# Altium project ADCS Interface Module 2 REVB.PrjPcb (part 1 of 2)
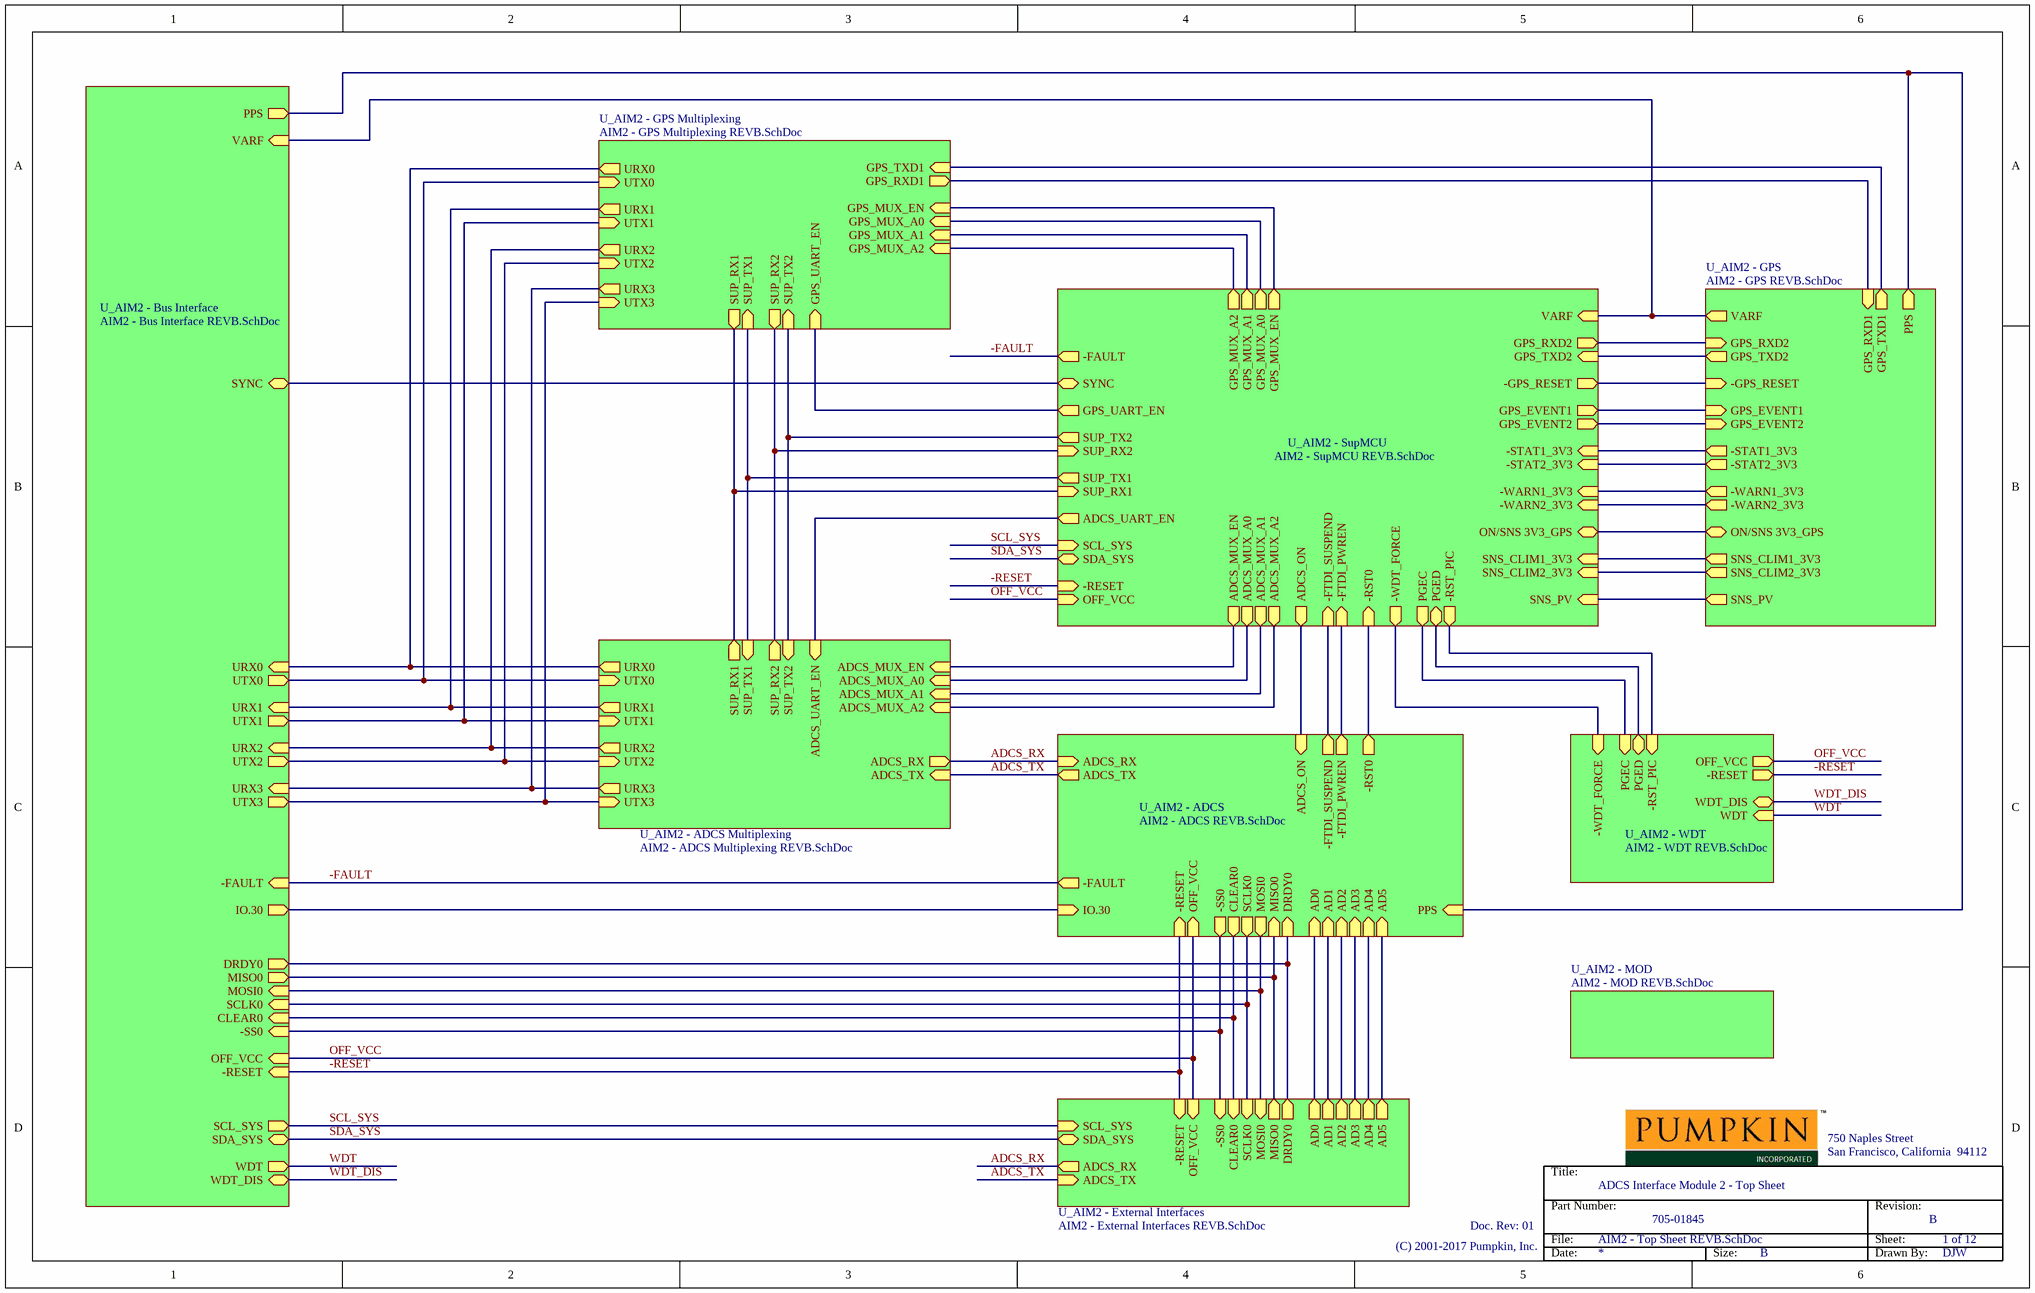
[diagram p0: AIM2 - Top Sheet REVB.SchDoc]
AssemblyNumber: 710-01846; PartNumber: 705-01845; ProjectRevision: B; ProjectTitle: ADCS Interface Module 2
12 sheets, 240 parts. Net scope: hierarchical (ports join the sheet entries above them; power ports are global).
Board file: AIM2 REVB.PcbDoc
Sheets:
  AIM2 - Top Sheet REVB.SchDoc
    U_AIM2 - WDT = AIM2 - WDT REVB.SchDoc
    U_AIM2 - ADCS = AIM2 - ADCS REVB.SchDoc
      U_AIM2 - FTDI = AIM2 - FTDI REVB.SchDoc
        U_AIM2 - UART LEDS = AIM2 - UART LEDS REVB.SchDoc
    U_AIM2 - ADCS Multiplexing = AIM2 - ADCS Multiplexing REVB.SchDoc
    U_AIM2 - Bus Interface = AIM2 - Bus Interface REVB.SchDoc
    U_AIM2 - External Interfaces = AIM2 - External Interfaces REVB.SchDoc
    U_AIM2 - GPS = AIM2 - GPS REVB.SchDoc
    U_AIM2 - GPS Multiplexing = AIM2 - GPS Multiplexing REVB.SchDoc
    U_AIM2 - SupMCU = AIM2 - SupMCU REVB.SchDoc
    U_AIM2 - MOD = AIM2 - MOD REVB.SchDoc

## Sheet AIM2 - Top Sheet REVB.SchDoc: Top Sheet
size B; DrawnBy: DJW; DocumentNumber: 1; SheetNumber: 1; SheetTotal: 12

### Sub-sheets
U_AIM2 - ADCS = AIM2 - ADCS REVB.SchDoc: DRDY0 (in), -RST0 (out), MISO0 (in), PPS (in), CLEAR0 (out), SCLK0 (out), MOSI0 (out), -SS0 (out), -RESET (in), OFF_VCC (in), ADCS_RX (in), ADCS_TX (out), ADCS_ON (in), IO.30 (in), -FAULT (out), -FTDI_PWREN (out), -FTDI_SUSPEND (out), AD5 (in), AD4 (in), AD3 (in), AD2 (in), AD1 (in), AD0 (in)
U_AIM2 - ADCS Multiplexing = AIM2 - ADCS Multiplexing REVB.SchDoc: UTX0 (in), URX1 (out), URX0 (out), UTX1 (in), UTX2 (in), URX2 (out), URX3 (out), UTX3 (in), SUP_RX1 (out), SUP_TX1 (in), SUP_RX2 (out), ADCS_RX (out), ADCS_TX (in), SUP_TX2 (in), ADCS_MUX_EN (in), ADCS_MUX_A0 (in), ADCS_MUX_A1 (in), ADCS_MUX_A2 (in), ADCS_UART_EN (in)
U_AIM2 - Bus Interface = AIM2 - Bus Interface REVB.SchDoc: URX0 (in), URX1 (in), URX2 (in), -RESET (in), OFF_VCC (in), SDA_SYS (bidir), SCL_SYS (out), SYNC (bidir), -FAULT (in), UTX2 (out), UTX1 (out), UTX0 (out), UTX3 (out), URX3 (in), WDT (out), IO.30 (out), MISO0 (out), PPS (out), DRDY0 (out), MOSI0 (in), -SS0 (in), SCLK0 (in), CLEAR0 (in), VARF (in), WDT_DIS (bidir)
U_AIM2 - External Interfaces = AIM2 - External Interfaces REVB.SchDoc: ADCS_RX (out), AD5 (out), -RESET (in), OFF_VCC (in), SCL_SYS (in), SDA_SYS (bidir), CLEAR0 (in), SCLK0 (in), -SS0 (in), MOSI0 (in), AD4 (out), AD3 (out), AD2 (out), AD1 (out), AD0 (out), ADCS_TX (in), MISO0 (out), DRDY0 (out)
U_AIM2 - GPS = AIM2 - GPS REVB.SchDoc: GPS_TXD1 (out), GPS_TXD2 (out), SNS_PV (out), VARF (out), PPS (out), -GPS_RESET (in), GPS_RXD1 (in), GPS_RXD2 (in), GPS_EVENT1 (in), GPS_EVENT2 (in), -STAT1_3V3 (out), -STAT2_3V3 (out), -WARN1_3V3 (out), -WARN2_3V3 (out), ON/SNS 3V3_GPS (bidir), SNS_CLIM2_3V3 (out), SNS_CLIM1_3V3 (out)
U_AIM2 - GPS Multiplexing = AIM2 - GPS Multiplexing REVB.SchDoc: UTX0 (in), URX1 (out), URX0 (out), UTX1 (in), UTX2 (in), URX2 (out), URX3 (out), UTX3 (in), SUP_RX1 (out), SUP_TX1 (in), GPS_RXD1 (out), GPS_TXD1 (in), GPS_MUX_EN (in), GPS_MUX_A0 (in), GPS_MUX_A1 (in), GPS_MUX_A2 (in), GPS_UART_EN (in), SUP_TX2 (in), SUP_RX2 (out)
U_AIM2 - MOD = AIM2 - MOD REVB.SchDoc: no entries
U_AIM2 - SupMCU = AIM2 - SupMCU REVB.SchDoc: GPS_RXD2 (out), GPS_TXD2 (in), -GPS_RESET (out), GPS_EVENT1 (out), GPS_EVENT2 (out), -STAT1_3V3 (in), -STAT2_3V3 (in), -WARN1_3V3 (in), -WARN2_3V3 (in), ON/SNS 3V3_GPS (bidir), SNS_CLIM1_3V3 (in), SNS_CLIM2_3V3 (in), SNS_PV (in), VARF (in), -RST0 (in), -FTDI_PWREN (in), -FTDI_SUSPEND (in), ADCS_ON (out), ADCS_MUX_A2 (out), ADCS_MUX_A1 (out), ADCS_MUX_A0 (out), ADCS_MUX_EN (out), GPS_MUX_EN (out), GPS_MUX_A0 (out), GPS_MUX_A1 (out), GPS_MUX_A2 (out), GPS_UART_EN (out), ADCS_UART_EN (out), SUP_TX2 (out), SUP_RX2 (in), SUP_TX1 (out), SUP_RX1 (in), -WDT_FORCE (out), PGEC (out), PGED (bidir), -RST_PIC (out), SYNC (bidir), SCL_SYS (in), SDA_SYS (bidir), OFF_VCC (in), -FAULT (out), -RESET (in)
U_AIM2 - WDT = AIM2 - WDT REVB.SchDoc: WDT (in), OFF_VCC (out), -RESET (out), -WDT_FORCE (in), PGEC (in), -RST_PIC (in), PGED (bidir), WDT_DIS (bidir)

### Nets
-FAULT: sheet U_AIM2 - ADCS/-FAULT, sheet U_AIM2 - Bus Interface/-FAULT, sheet U_AIM2 - SupMCU/-FAULT
-FTDI_PWREN: sheet U_AIM2 - ADCS/-FTDI_PWREN, sheet U_AIM2 - SupMCU/-FTDI_PWREN
-FTDI_SUSPEND: sheet U_AIM2 - ADCS/-FTDI_SUSPEND, sheet U_AIM2 - SupMCU/-FTDI_SUSPEND
-GPS_RESET: sheet U_AIM2 - GPS/-GPS_RESET, sheet U_AIM2 - SupMCU/-GPS_RESET
-RESET: sheet U_AIM2 - WDT/-RESET, sheet U_AIM2 - ADCS/-RESET, sheet U_AIM2 - Bus Interface/-RESET, sheet U_AIM2 - External Interfaces/-RESET, sheet U_AIM2 - SupMCU/-RESET
-RST0: sheet U_AIM2 - ADCS/-RST0, sheet U_AIM2 - SupMCU/-RST0
-RST_PIC: sheet U_AIM2 - WDT/-RST_PIC, sheet U_AIM2 - SupMCU/-RST_PIC
-SS0: sheet U_AIM2 - ADCS/-SS0, sheet U_AIM2 - Bus Interface/-SS0, sheet U_AIM2 - External Interfaces/-SS0
-STAT1_3V3: sheet U_AIM2 - GPS/-STAT1_3V3, sheet U_AIM2 - SupMCU/-STAT1_3V3
-STAT2_3V3: sheet U_AIM2 - GPS/-STAT2_3V3, sheet U_AIM2 - SupMCU/-STAT2_3V3
-WARN1_3V3: sheet U_AIM2 - GPS/-WARN1_3V3, sheet U_AIM2 - SupMCU/-WARN1_3V3
-WARN2_3V3: sheet U_AIM2 - GPS/-WARN2_3V3, sheet U_AIM2 - SupMCU/-WARN2_3V3
-WDT_FORCE: sheet U_AIM2 - WDT/-WDT_FORCE, sheet U_AIM2 - SupMCU/-WDT_FORCE
AD0: sheet U_AIM2 - ADCS/AD0, sheet U_AIM2 - External Interfaces/AD0
AD1: sheet U_AIM2 - ADCS/AD1, sheet U_AIM2 - External Interfaces/AD1
AD2: sheet U_AIM2 - ADCS/AD2, sheet U_AIM2 - External Interfaces/AD2
AD3: sheet U_AIM2 - ADCS/AD3, sheet U_AIM2 - External Interfaces/AD3
AD4: sheet U_AIM2 - ADCS/AD4, sheet U_AIM2 - External Interfaces/AD4
AD5: sheet U_AIM2 - ADCS/AD5, sheet U_AIM2 - External Interfaces/AD5
ADCS_MUX_A0: sheet U_AIM2 - ADCS Multiplexing/ADCS_MUX_A0, sheet U_AIM2 - SupMCU/ADCS_MUX_A0
ADCS_MUX_A1: sheet U_AIM2 - ADCS Multiplexing/ADCS_MUX_A1, sheet U_AIM2 - SupMCU/ADCS_MUX_A1
ADCS_MUX_A2: sheet U_AIM2 - ADCS Multiplexing/ADCS_MUX_A2, sheet U_AIM2 - SupMCU/ADCS_MUX_A2
ADCS_MUX_EN: sheet U_AIM2 - ADCS Multiplexing/ADCS_MUX_EN, sheet U_AIM2 - SupMCU/ADCS_MUX_EN
ADCS_ON: sheet U_AIM2 - ADCS/ADCS_ON, sheet U_AIM2 - SupMCU/ADCS_ON
ADCS_RX: sheet U_AIM2 - ADCS/ADCS_RX, sheet U_AIM2 - ADCS Multiplexing/ADCS_RX, sheet U_AIM2 - External Interfaces/ADCS_RX
ADCS_TX: sheet U_AIM2 - ADCS/ADCS_TX, sheet U_AIM2 - ADCS Multiplexing/ADCS_TX, sheet U_AIM2 - External Interfaces/ADCS_TX
ADCS_UART_EN: sheet U_AIM2 - ADCS Multiplexing/ADCS_UART_EN, sheet U_AIM2 - SupMCU/ADCS_UART_EN
CLEAR0: sheet U_AIM2 - ADCS/CLEAR0, sheet U_AIM2 - Bus Interface/CLEAR0, sheet U_AIM2 - External Interfaces/CLEAR0
DRDY0: sheet U_AIM2 - ADCS/DRDY0, sheet U_AIM2 - Bus Interface/DRDY0, sheet U_AIM2 - External Interfaces/DRDY0
GPS_EVENT1: sheet U_AIM2 - GPS/GPS_EVENT1, sheet U_AIM2 - SupMCU/GPS_EVENT1
GPS_EVENT2: sheet U_AIM2 - GPS/GPS_EVENT2, sheet U_AIM2 - SupMCU/GPS_EVENT2
GPS_MUX_A0: sheet U_AIM2 - GPS Multiplexing/GPS_MUX_A0, sheet U_AIM2 - SupMCU/GPS_MUX_A0
GPS_MUX_A1: sheet U_AIM2 - GPS Multiplexing/GPS_MUX_A1, sheet U_AIM2 - SupMCU/GPS_MUX_A1
GPS_MUX_A2: sheet U_AIM2 - GPS Multiplexing/GPS_MUX_A2, sheet U_AIM2 - SupMCU/GPS_MUX_A2
GPS_MUX_EN: sheet U_AIM2 - GPS Multiplexing/GPS_MUX_EN, sheet U_AIM2 - SupMCU/GPS_MUX_EN
GPS_RXD2: sheet U_AIM2 - GPS/GPS_RXD2, sheet U_AIM2 - SupMCU/GPS_RXD2
GPS_TXD2: sheet U_AIM2 - GPS/GPS_TXD2, sheet U_AIM2 - SupMCU/GPS_TXD2
GPS_UART_EN: sheet U_AIM2 - GPS Multiplexing/GPS_UART_EN, sheet U_AIM2 - SupMCU/GPS_UART_EN
IO.30: sheet U_AIM2 - ADCS/IO.30, sheet U_AIM2 - Bus Interface/IO.30
MISO0: sheet U_AIM2 - ADCS/MISO0, sheet U_AIM2 - Bus Interface/MISO0, sheet U_AIM2 - External Interfaces/MISO0
MOSI0: sheet U_AIM2 - ADCS/MOSI0, sheet U_AIM2 - Bus Interface/MOSI0, sheet U_AIM2 - External Interfaces/MOSI0
OFF_VCC: sheet U_AIM2 - WDT/OFF_VCC, sheet U_AIM2 - ADCS/OFF_VCC, sheet U_AIM2 - Bus Interface/OFF_VCC, sheet U_AIM2 - External Interfaces/OFF_VCC, sheet U_AIM2 - SupMCU/OFF_VCC
ON/SNS 3V3_GPS: sheet U_AIM2 - GPS/ON/SNS 3V3_GPS, sheet U_AIM2 - SupMCU/ON/SNS 3V3_GPS
PGEC: sheet U_AIM2 - WDT/PGEC, sheet U_AIM2 - SupMCU/PGEC
PGED: sheet U_AIM2 - WDT/PGED, sheet U_AIM2 - SupMCU/PGED
PPS: sheet U_AIM2 - ADCS/PPS, sheet U_AIM2 - Bus Interface/PPS, sheet U_AIM2 - GPS/PPS
SCL_SYS: sheet U_AIM2 - Bus Interface/SCL_SYS, sheet U_AIM2 - External Interfaces/SCL_SYS, sheet U_AIM2 - SupMCU/SCL_SYS
SCLK0: sheet U_AIM2 - ADCS/SCLK0, sheet U_AIM2 - Bus Interface/SCLK0, sheet U_AIM2 - External Interfaces/SCLK0
SDA_SYS: sheet U_AIM2 - Bus Interface/SDA_SYS, sheet U_AIM2 - External Interfaces/SDA_SYS, sheet U_AIM2 - SupMCU/SDA_SYS
SNS_CLIM1_3V3: sheet U_AIM2 - GPS/SNS_CLIM1_3V3, sheet U_AIM2 - SupMCU/SNS_CLIM1_3V3
SNS_CLIM2_3V3: sheet U_AIM2 - GPS/SNS_CLIM2_3V3, sheet U_AIM2 - SupMCU/SNS_CLIM2_3V3
SNS_PV: sheet U_AIM2 - GPS/SNS_PV, sheet U_AIM2 - SupMCU/SNS_PV
SUP_RX1: sheet U_AIM2 - ADCS Multiplexing/SUP_RX1, sheet U_AIM2 - GPS Multiplexing/SUP_RX1, sheet U_AIM2 - SupMCU/SUP_RX1
SUP_RX2: sheet U_AIM2 - ADCS Multiplexing/SUP_RX2, sheet U_AIM2 - GPS Multiplexing/SUP_RX2, sheet U_AIM2 - SupMCU/SUP_RX2
SUP_TX1: sheet U_AIM2 - ADCS Multiplexing/SUP_TX1, sheet U_AIM2 - GPS Multiplexing/SUP_TX1, sheet U_AIM2 - SupMCU/SUP_TX1
SUP_TX2: sheet U_AIM2 - ADCS Multiplexing/SUP_TX2, sheet U_AIM2 - GPS Multiplexing/SUP_TX2, sheet U_AIM2 - SupMCU/SUP_TX2
SYNC: sheet U_AIM2 - Bus Interface/SYNC, sheet U_AIM2 - SupMCU/SYNC
URX0: sheet U_AIM2 - ADCS Multiplexing/URX0, sheet U_AIM2 - Bus Interface/URX0, sheet U_AIM2 - GPS Multiplexing/URX0
URX1: sheet U_AIM2 - ADCS Multiplexing/URX1, sheet U_AIM2 - Bus Interface/URX1, sheet U_AIM2 - GPS Multiplexing/URX1
URX2: sheet U_AIM2 - ADCS Multiplexing/URX2, sheet U_AIM2 - Bus Interface/URX2, sheet U_AIM2 - GPS Multiplexing/URX2
URX3: sheet U_AIM2 - ADCS Multiplexing/URX3, sheet U_AIM2 - Bus Interface/URX3, sheet U_AIM2 - GPS Multiplexing/URX3
UTX0: sheet U_AIM2 - ADCS Multiplexing/UTX0, sheet U_AIM2 - Bus Interface/UTX0, sheet U_AIM2 - GPS Multiplexing/UTX0
UTX1: sheet U_AIM2 - ADCS Multiplexing/UTX1, sheet U_AIM2 - Bus Interface/UTX1, sheet U_AIM2 - GPS Multiplexing/UTX1
UTX2: sheet U_AIM2 - ADCS Multiplexing/UTX2, sheet U_AIM2 - Bus Interface/UTX2, sheet U_AIM2 - GPS Multiplexing/UTX2
UTX3: sheet U_AIM2 - ADCS Multiplexing/UTX3, sheet U_AIM2 - Bus Interface/UTX3, sheet U_AIM2 - GPS Multiplexing/UTX3
VARF: sheet U_AIM2 - Bus Interface/VARF, sheet U_AIM2 - GPS/VARF, sheet U_AIM2 - SupMCU/VARF
WDT: sheet U_AIM2 - WDT/WDT, sheet U_AIM2 - Bus Interface/WDT
WDT_DIS: sheet U_AIM2 - WDT/WDT_DIS, sheet U_AIM2 - Bus Interface/WDT_DIS
NetU12_11: sheet U_AIM2 - GPS/GPS_TXD1, sheet U_AIM2 - GPS Multiplexing/GPS_TXD1
NetU12_12: sheet U_AIM2 - GPS/GPS_RXD1, sheet U_AIM2 - GPS Multiplexing/GPS_RXD1

### Notes on the sheet
- Title:
- 750 Naples Street
- San Francisco, California  94112
- Doc. Rev: 01
- File:
- Part Number:
- Revision:
- Sheet:
- (C) 2001-2017 Pumpkin, Inc.
- Date:
- Size:
- B
- Drawn By:

## Sheet AIM2 - WDT REVB.SchDoc: Watchdog Timer
size B; DrawnBy: DJW; DocumentNumber: 12; SheetNumber: 12; SheetTotal: 12
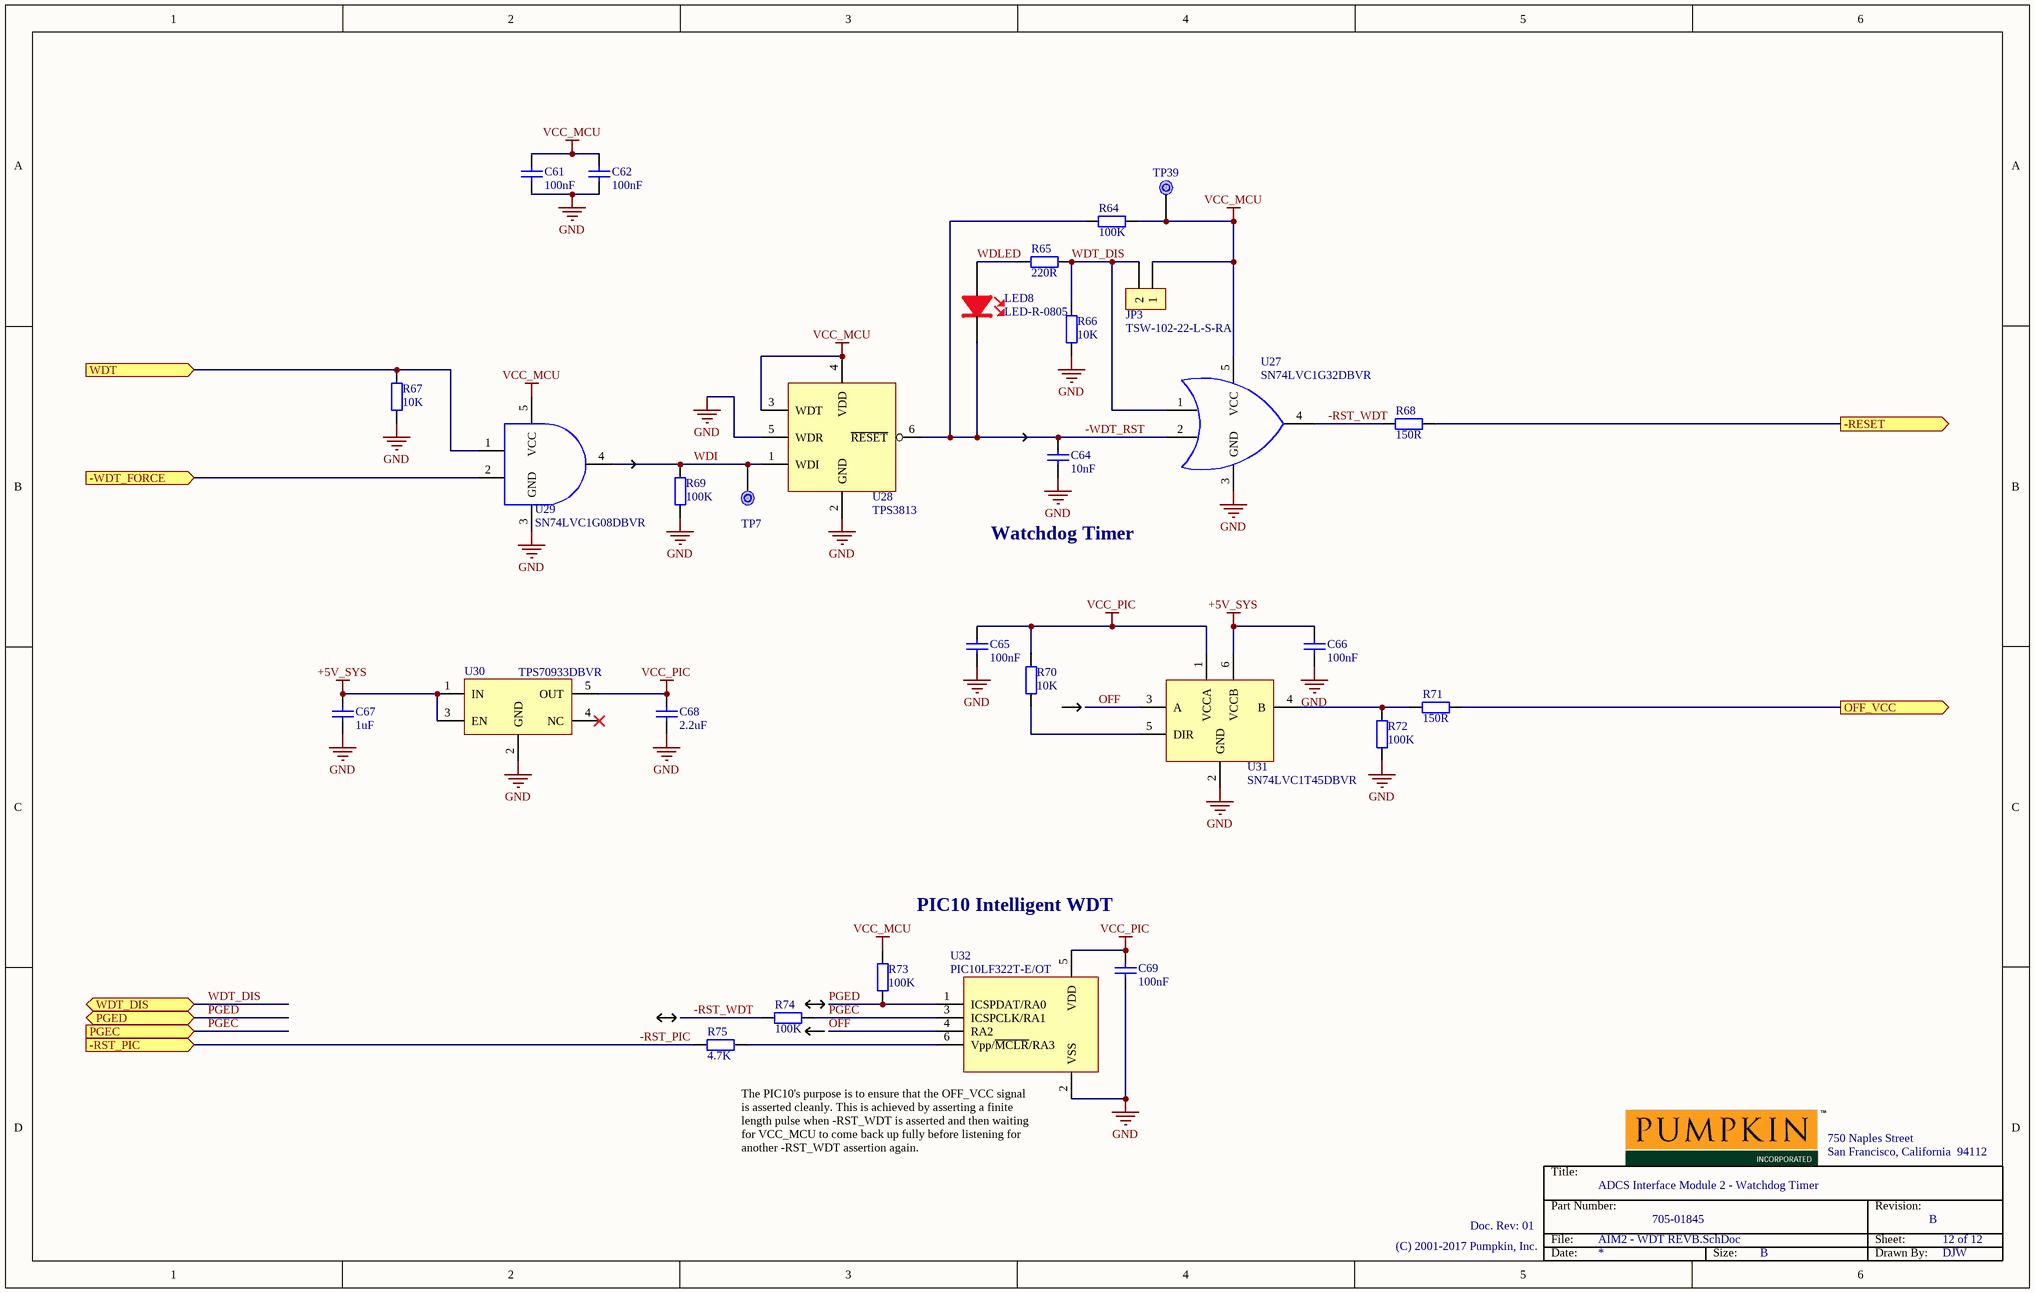
[diagram p1: AIM2 - WDT REVB.SchDoc]

### Parts
C61  100nF  [0603 CAP]
C62  100nF  [0603 CAP]
C64  10nF  [0805 CAP]
C65  100nF  [0603 CAP]
C66  100nF  [0603 CAP]
C67  1uF  [0805 CAP]
C68  2.2uF  [0805 CAP]
C69  100nF  [0603 CAP]
JP3  TSW-102-22-L-S-RA  [TSW-102-22-L-S-RA]
LED8  LED-R-0805  [0805 LED-RED]
R64  100K  [0805 RES]
R65  220R  [0805 RES]
R66  10K  [0805 RES]
R67  10K  [0805 RES]
R68  150R  [0805 RES]
R69  100K  [0805 RES]
R70  10K  [0805 RES]
R71  150R  [0805 RES]
R72  100K  [0805 RES]
R73  100K  [0805 RES]
R74  100K  [0805 RES]
R75  4.7K  [0805 RES]
TP7  Testpoint  [Testpoint]  (value not drawn)  (no BOM)
TP39  Testpoint  [Testpoint]  (value not drawn)  (no BOM)
U27  SN74LVC1G32DBVR  [SOT23-5]
U28  TPS3813  [SOT23-6]
U29  SN74LVC1G08DBVR  [SOT23-5]
U30  TPS70933DBVR  [SOT23-5]
U31  SN74LVC1T45DBVR  [SOT23-6]
U32  PIC10LF322T-E/OT  [SOT23-6]

### Ports
-RESET (out), -RST_PIC (in), -WDT_FORCE (in), OFF_VCC (out), PGEC (in), PGED (bidir), WDT (in), WDT_DIS (bidir)

### Nets
+5V_SYS: C66.2 C67.1 U30.1(IN) U30.3(EN) U31.6(VCCB)
GND: C61.1 C62.1 C64.1 C65.1 C66.1 C67.2 C68.1 C69.1 R66.1 R67.1 R69.1 R72.2 U27.3(GND) U28.2(GND) U28.5(WDR) U29.3(GND) U30.2(GND) U31.2(GND) U32.2(VSS)
VCC_MCU: C61.2 C62.2 JP3.1 R64.1 R73.2 TP39.1 U27.5(VCC) U28.3(WDT) U28.4(VDD) U29.5(VCC)
VCC_PIC: C65.2 C68.2 C69.2 R70.2 U30.5(OUT) U31.1(VCCA) U32.5(VDD)
-RESET: R68.2 ; port -RESET
-RST_PIC: R75.2 ; port -RST_PIC
-RST_WDT: R68.1 R74.1 U27.4(A+B)
-WDT_FORCE: U29.2 ; port -WDT_FORCE
-WDT_RST: C64.2 LED8.1 R64.2 U27.2(1B) U28.6(~{RESET})
OFF: U31.3(A) U32.4(RA2)
OFF_VCC: R71.2 ; port OFF_VCC
PGEC: R74.2 U32.3(ICSPCLK/RA1) ; port PGEC
PGED: R73.1 U32.1(ICSPDAT/RA0) ; port PGED
WDI: R69.2 TP7.1 U28.1(WDI) U29.4
WDLED: LED8.2 R65.1
WDT: R67.2 U29.1 ; port WDT
WDT_DIS: JP3.2 R65.2 R66.2 U27.1(1A) ; port WDT_DIS
NetR70_1: R70.1 U31.5(DIR)
NetR71_1: R71.1 R72.1 U31.4(B)
NetR75_1: R75.1 U32.6(Vpp/~{MCLR}/RA3)

Not connected (* = marked no-connect by the designer): U30 4(NC)*

### Notes on the sheet
- Watchdog Timer
- PIC10 Intelligent WDT
- (near U32) The PIC10's purpose is to ensure that the OFF_VCC signal is asserted cleanly. This is achieved by asserting a finite length pulse when -RST_WDT is asserted and then waiting for VCC_MCU to come back up fully before listening for another -RST_WDT assertion again.
- Title:
- 750 Naples Street
- San Francisco, California  94112
- Doc. Rev: 01
- File:
- Part Number:
- Revision:
- Sheet:
- (C) 2001-2017 Pumpkin, Inc.
- Date:
- Size:
- B
- Drawn By:

### Library data of the parts
C61 C62 C65 C66 C69 = Capacitor 100nF 0603: Capacitor 100nF 0603 X7R 50V 5%; Value: 100nF; Supplier 1: Digi-Key; Supplier Part Number 1: 399-7844-1-ND
C64 = Capacitor 10nF 0805: Capacitor 10nF 0805 X7R 50V 5%; Value: 10nF; Supplier 1: Digi-Key; Supplier Part Number 1: 478-3768-1-ND
C67 = Capacitor 1uF 0805: Capacitor 1uF 0805 X7R 25V 10%; Value: 1uF; Supplier 1: Digi-Key; Supplier Part Number 1: 445-5687-1-ND
C68 = Capacitor 2.2uF 0805: Capacitor 2.2uF 0805 X7R 35V 10%; Voltage Rating: 50V; Value: 2.2uF; Supplier 1: Digi-Key; Supplier Part Number 1: 445-8787-1-ND
JP3 = 2x1 RA Header TH raised: Header 2x1 RA TH raised; Supplier 1: Digi-Key; Supplier Part Number 1: TSW-102-22-L-S-RA-ND
LED8 = LED RED 0805: Supplier 1: Digi-Key; Supplier Part Number 1: 160-1415-1-ND
R64 R69 R72-R74 = Resistor 100K 0805: Resistor 100K 0805 0.5W 1%; Revision: Altium ETH 11-03.2008; Value: 100K; Supplier 1: Digi-Key; Supplier Part Number 1: P16060CT-ND
R65 = Resistor 220R 0805: Resistor 220R 0805 0.125W 1%; Revision: Altium ETH 11-03.2008; Value: 220R; Supplier 1: Digi-Key; Supplier Part Number 1: P220CCT-ND
R66 R67 R70 = Resistor 10K 0805: Resistor 10K 0805 0.125W 1%; Revision: Altium ETH 11-03.2008; Supplier 1: Digi-Key; Supplier Part Number 1: 311-10.0KCRCT-ND; Value: 10K
R68 R71 = Resistor 150R 0805: Resistor 150R 0805 0.125W 1%; Revision: Altium ETH 11-03.2008; Value: 150R; Supplier 1: Digi-Key; Supplier Part Number 1: P150CCT-ND
R75 = Resistor 4K7 0805: Resistor 4.7K 0805 0.125W 1%; Revision: Altium ETH 11-03.2008; Value: 4.7K; Supplier 1: Digi-Key; Supplier Part Number 1: 311-4.70KCRCT-ND
U27 = SN74LVC1G32DBVR: IC Logic OR 1 channel; Supplier 1: Digi-Key; Supplier Part Number 1: 296-9847-1-ND
U28 = TPS3813: IC Supervisor Watchdog; Supplier 1: Digi-Key; Supplier Part Number 1: 296-10920-1-ND
U29 = SN74LVC1G08DBVR: IC Logic AND 2 input; Supplier 1: Digi-Key; Supplier Part Number 1: 296-11601-1-ND
U30 = TPS70933: Regulator 3.3 V LDO; Supplier 1: Digi-Key; Supplier Part Number 1: 296-35483-1-ND
U31 = SN74LVC1T45DBVR: IC Logic Isolator 1 channel; Supplier 1: Digi-Key; Supplier Part Number 1: 296-16843-1-ND
U32 = PIC10LF322T-E/OT: IC Processor 8 bit; Supplier 1: Digi-Key; Supplier Part Number 1: PIC10LF322T-E/OTCT-ND

## Sheet AIM2 - ADCS REVB.SchDoc: External Interfaces
size B; DrawnBy: DJW; DocumentNumber: 3; SheetNumber: 3; SheetTotal: 12; PageSetup: Record=PageOptions|CenterHorizontal=True|CenterVertical=True|PrintScale=0.72|XCorrection=1.00|YCorrection=1.00|PrintKind=1|BorderSize=5000000|LeftOffset=0|BottomOffset=0|Orientation=2|PaperLength=1000|PaperWidth=1000|Scale=100|PaperSource=7|PrintQuality=600|MediaType=1|DitherType=10|PrintScaleMode=1|PaperKind=Letter|PaperIndex=1
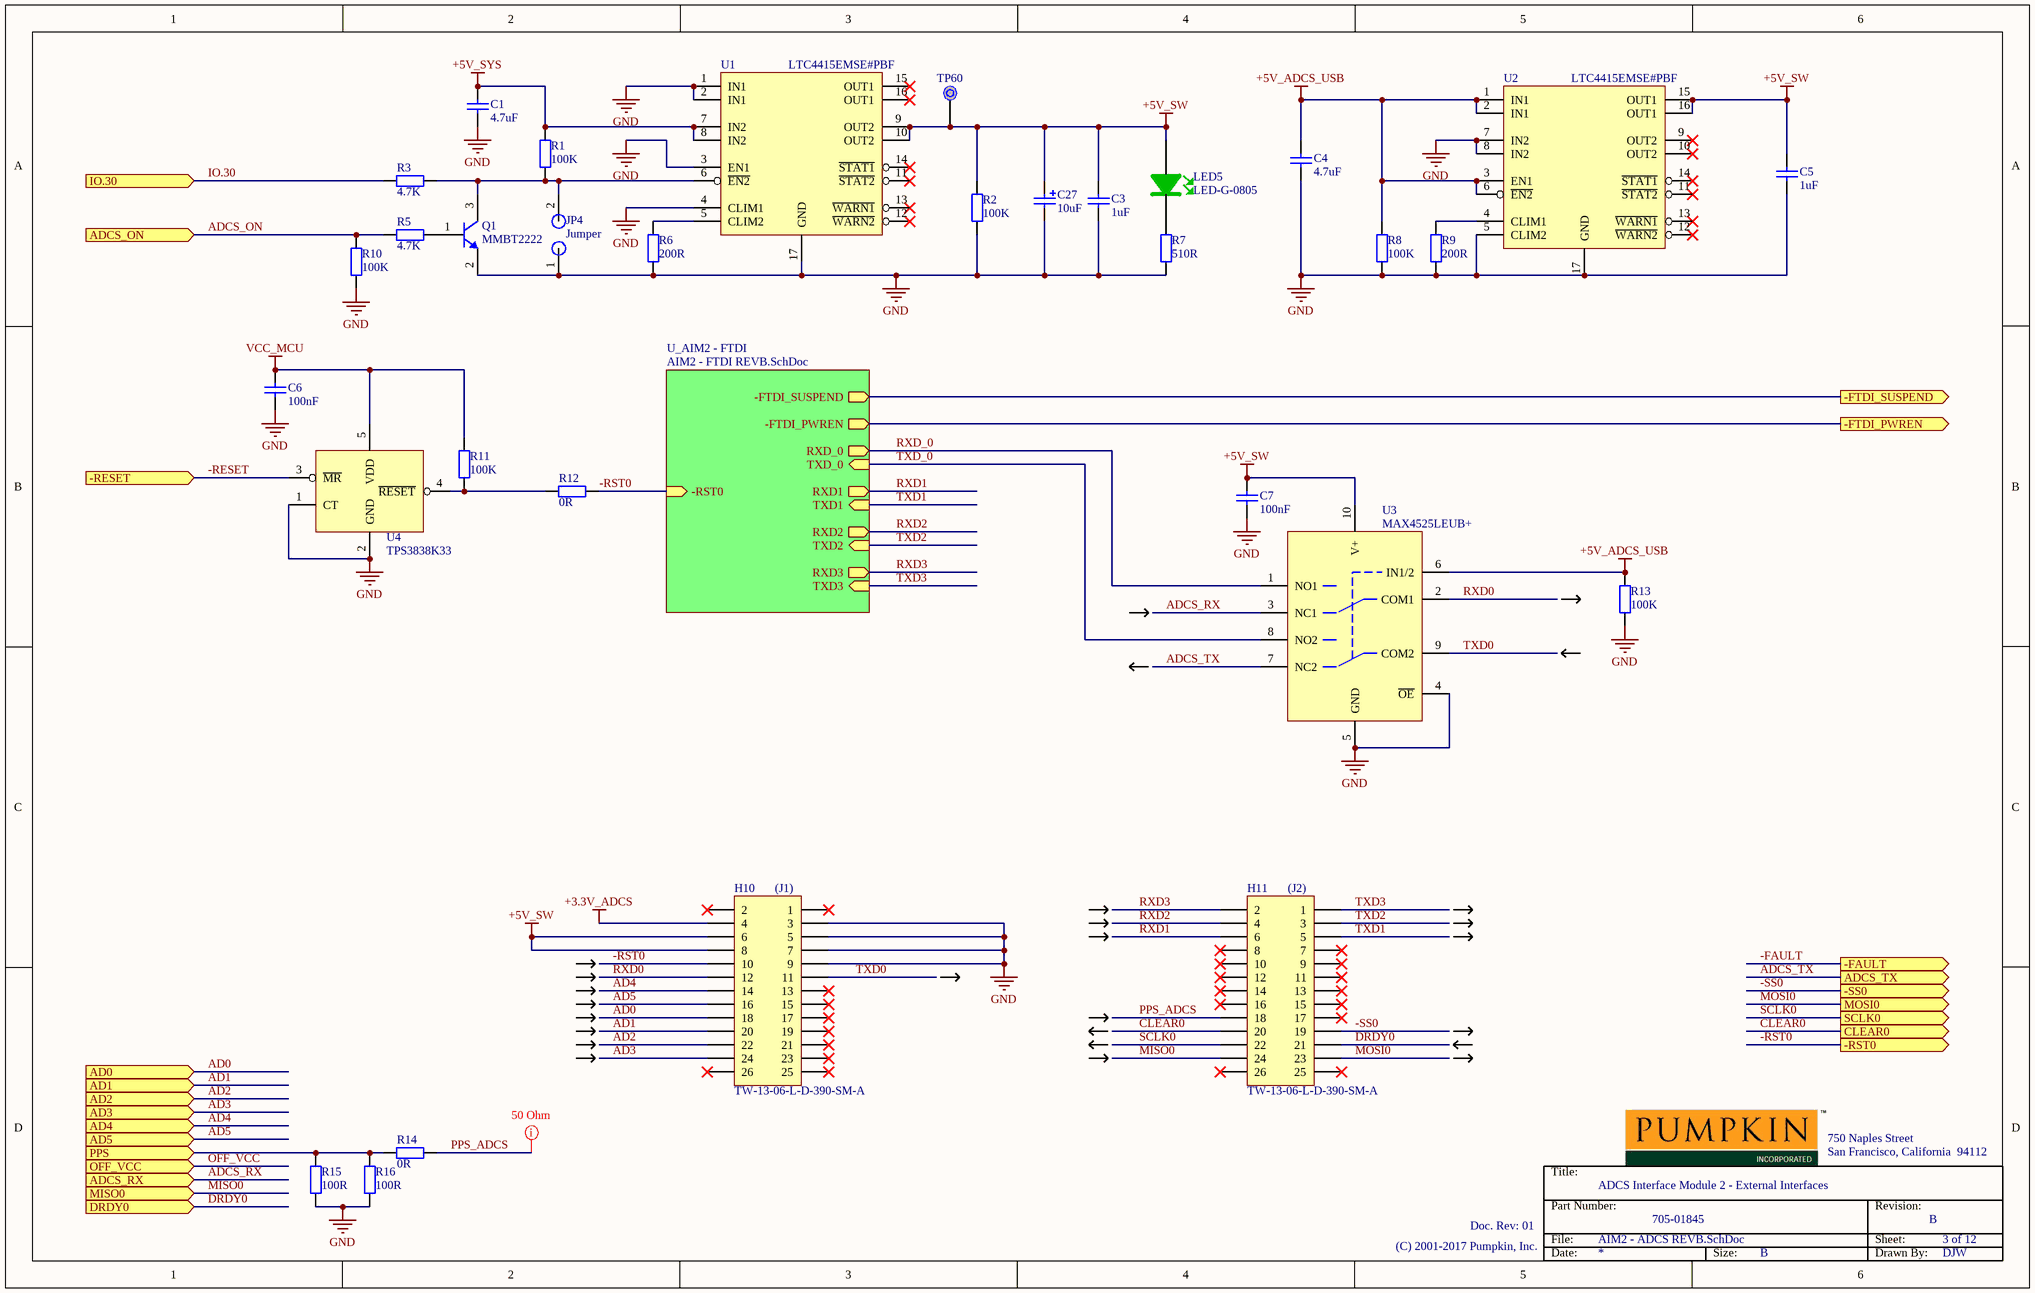
[diagram p2: AIM2 - ADCS REVB.SchDoc]

### Parts
C1  4.7uF  [0805 CAP]
C3  1uF  [0805 CAP]
C4  4.7uF  [0805 CAP]
C5  1uF  [0805 CAP]
C6  100nF  [0603 CAP]
C7  100nF  [0603 CAP]
C27  10uF  [6032 POLAR CAP]
H10  TW-13-06-L-D-390-SM-A  [TW-13-06-X-D-390-SM-A]
H11  TW-13-06-L-D-390-SM-A  [TW-13-06-X-D-390-SM-A]
JP4  Jumper  [0805 RES 1 way jumper]
LED5  LED-G-0805  [0805 LED-GREEN]
Q1  MMBT2222  [SOT23-3]
R1  100K  [0805 RES]
R2  100K  [0805 RES]
R3  4.7K  [0805 RES]
R5  4.7K  [0805 RES]
R6  200R  [0805 RES]
R7  510R  [0805 RES]
R8  100K  [0805 RES]
R9  200R  [0805 RES]
R10  100K  [0805 RES]
R11  100K  [0805 RES]
R12  0R  [0805 RES]
R13  100K  [0805 RES]
R14  0R  [0805 RES]
R15  100R  [0805 RES]
R16  100R  [0805 RES]
TP60  Testpoint  [Testpoint]  (value not drawn)  (no BOM)
U1  LTC4415EMSE#PBF  [MSOP-16]
U2  LTC4415EMSE#PBF  [MSOP-16]
U3  MAX4525LEUB+  [MSOP-10]
U4  TPS3838K33  [SOT23-5]

### Sub-sheets
U_AIM2 - FTDI = AIM2 - FTDI REVB.SchDoc: -RST0 (in), -FTDI_SUSPEND (out), -FTDI_PWREN (out), TXD_0 (in), RXD_0 (out), TXD1 (in), RXD1 (out), TXD2 (in), RXD2 (out), TXD3 (in), RXD3 (out)

### Ports
-FAULT (out), -FTDI_PWREN (out), -FTDI_SUSPEND (out), -RESET (in), -RST0 (out), -SS0 (out), AD0 (in), AD1 (in), AD2 (in), AD3 (in), AD4 (in), AD5 (in), ADCS_ON (in), ADCS_RX (in), ADCS_TX (out), CLEAR0 (out), DRDY0 (in), IO.30 (in), MISO0 (in), MOSI0 (out), OFF_VCC (in), PPS (in), SCLK0 (out)

### Nets
+3.3V_ADCS: H10.4
+5V_ADCS_USB: C4.2 R8.2 R13.2 U2.1(IN1) U2.2(IN1) U2.3(EN1) U2.6(~{EN2}) U3.6(IN1/2)
+5V_SW: C3.2 C5.2 C7.2 C27.1 H10.6 H10.8 LED5.2 R2.2 TP60.1 U1.9(OUT2) U1.10(OUT2) U2.15(OUT1) U2.16(OUT1) U3.10(V+)
+5V_SYS: C1.2 R1.2 U1.7(IN2) U1.8(IN2)
GND: C1.1 C3.1 C4.1 C5.1 C6.1 C7.1 C27.2 H10.3 H10.5 H10.7 H10.9 JP4.1 Q1.2(E) R2.1 R6.1 R7.1 R8.1 R9.1 R10.1 R13.1 R15.1 R16.1 U1.1(IN1) U1.2(IN1) U1.3(EN1) U1.4(CLIM1) U1.17(GND) U2.5(CLIM2) U2.7(IN2) U2.8(IN2) U2.17(GND) U3.4(~{OE}) U3.5(GND) U4.1(CT) U4.2(GND)
VCC_MCU: C6.2 R11.2 U4.5(VDD)
-FTDI_PWREN: port -FTDI_PWREN, sheet U_AIM2 - FTDI/-FTDI_PWREN
-FTDI_SUSPEND: port -FTDI_SUSPEND, sheet U_AIM2 - FTDI/-FTDI_SUSPEND
-RESET: U4.3(~{MR}) ; port -RESET
-RST0: H10.10 R12.2 ; port -RST0, sheet U_AIM2 - FTDI/-RST0
-SS0: H11.19 ; port -SS0
AD0: H10.18 ; port AD0
AD1: H10.20 ; port AD1
AD2: H10.22 ; port AD2
AD3: H10.24 ; port AD3
AD4: H10.14 ; port AD4
AD5: H10.16 ; port AD5
ADCS_ON: R5.1 R10.2 ; port ADCS_ON
ADCS_RX: U3.3(NC1) ; port ADCS_RX
ADCS_TX: U3.7(NC2) ; port ADCS_TX
CLEAR0: H11.20 ; port CLEAR0
DRDY0: H11.21 ; port DRDY0
IO.30: R3.1 ; port IO.30
MISO0: H11.24 ; port MISO0
MOSI0: H11.23 ; port MOSI0
PPS: R14.1 R15.2 R16.2 ; port PPS
PPS_ADCS: H11.18 R14.2
RXD0: H10.12 U3.2(COM1)
RXD1: H11.6 ; sheet U_AIM2 - FTDI/RXD1
RXD2: H11.4 ; sheet U_AIM2 - FTDI/RXD2
RXD3: H11.2 ; sheet U_AIM2 - FTDI/RXD3
RXD_0: U3.1(NO1) ; sheet U_AIM2 - FTDI/RXD_0
SCLK0: H11.22 ; port SCLK0
TXD0: H10.11 U3.9(COM2)
TXD1: H11.5 ; sheet U_AIM2 - FTDI/TXD1
TXD2: H11.3 ; sheet U_AIM2 - FTDI/TXD2
TXD3: H11.1 ; sheet U_AIM2 - FTDI/TXD3
TXD_0: U3.8(NO2) ; sheet U_AIM2 - FTDI/TXD_0
NetJP4_2: JP4.2 Q1.3(C) R1.1 R3.2 U1.6(~{EN2})
NetLED5_1: LED5.1 R7.2
NetQ1_1: Q1.1(B) R5.2
NetR6_2: R6.2 U1.5(CLIM2)
NetR9_2: R9.2 U2.4(CLIM1)
NetR11_1: R11.1 R12.1 U4.4(~{RESET})

Not connected (* = marked no-connect by the designer): H10 1* 2* 13* 15* 17* 19* 21* 23* 25* 26*; H11 7* 8* 9* 10* 11* 12* 13* 14* 15* 16* 17* 25* 26*; U1 11(~{STAT2})* 12(~{WARN2})* 13(~{WARN1})* 14(~{STAT1})* 15(OUT1)* 16(OUT1)*; U2 9(OUT2)* 10(OUT2)* 11(~{STAT2})* 12(~{WARN2})* 13(~{WARN1})* 14(~{STAT1})*

### Layout directives
net class 50 Ohm: PPS_ADCS

### Notes on the sheet
- (near H10) (J1)
- (near H11) (J2)
- Title:
- 750 Naples Street
- San Francisco, California  94112
- Doc. Rev: 01
- File:
- Part Number:
- Revision:
- Sheet:
- (C) 2001-2017 Pumpkin, Inc.
- Date:
- Size:
- B
- Drawn By:

### Library data of the parts
C1 C4 = Capacitor 4.7uF 0805: Capacitor 4.7uF 0805 X7R 35V 10%; Value: 4.7uF; Supplier 1: Digi-Key; Supplier Part Number 1: 445-172479-1-ND
C3 C5 = Capacitor 1uF 0805: Capacitor 1uF 0805 X7R 25V 10%; Value: 1uF; Supplier 1: Digi-Key; Supplier Part Number 1: 445-5687-1-ND
C6 C7 = Capacitor 100nF 0603: Capacitor 100nF 0603 X7R 50V 5%; Value: 100nF; Supplier 1: Digi-Key; Supplier Part Number 1: 399-7844-1-ND
C27 = Capacitor 10uF 6032 Tantalum: Capacitor 10uF 6032 TANT 16V 10%; Value: 10uF; Supplier 1: Digi-Key; Supplier Part Number 1: 399-3732-1-ND
H10 H11 = 13x2 2mm Header: Header 13x2 TH 2mm pitch; Supplier 1: Newark; Supplier Part Number 1: 73X0656
JP4 = Jumper 1 way 0805: Jumper 0805 1 pos; Supplier 1: Digi-Key; Supplier Part Number 1: P0.0ACT-ND
LED5 = LED GREEN 0805: Supplier 1: Digi-Key; Supplier Part Number 1: 160-1414-1-ND
Q1 = MMBT2222ALT1GOSCT-ND: Transistor NPN; Supplier 1: Digi-Key; Supplier Part Number 1: MMBT2222ALT1GOSCT-ND
R1 R2 R8 R10 R11 R13 = Resistor 100K 0805: Resistor 100K 0805 0.5W 1%; Revision: Altium ETH 11-03.2008; Value: 100K; Supplier 1: Digi-Key; Supplier Part Number 1: P16060CT-ND
R3 R5 = Resistor 4K7 0805: Resistor 4.7K 0805 0.125W 1%; Revision: Altium ETH 11-03.2008; Value: 4.7K; Supplier 1: Digi-Key; Supplier Part Number 1: 311-4.70KCRCT-ND
R6 R9 = Resistor 200R 0805: Resistor 200R 0805 0.125W 1%; Revision: Altium ETH 11-03.2008; Value: 200R; Supplier 1: Digi-Key; Supplier Part Number 1: 311-200CRCT-ND
R7 = Resistor 510R 0805: Resistor 470K 0805 0.125W 1%; Revision: Altium ETH 11-03.2008; Value: 510R; Supplier 1: Digi-Key; Supplier Part Number 1: 311-470KCRCT-ND
R12 R14 = Resistor 0R 0805: Resistor 0R 0805 0.125W; Revision: Altium ETH 11-03.2008; Value: 0R; Supplier 1: Digi-Key; Supplier Part Number 1: P0.0ACT-ND
R15 R16 = Resistor 100R 0805: Resistor 100R 0805 0.125W 1%; Revision: Altium ETH 11-03.2008; Value: 100R; Supplier 1: Digi-Key; Supplier Part Number 1: P100CCT-ND
U1 U2 = LTC4415: IC Driver Dual Idewal Diode; Supplier 1: Digi-Key; Supplier Part Number 1: LTC4415EMSE#PBF-ND
U3 = MAX4525LEUB+: IC Analog Switch DPDT; Supplier 1: Digi-Key; Supplier Part Number 1: MAX4525LEUB+-ND
U4 = TPS3838K33DBVR: IC Supervisor Reset; Supplier 1: Digi-Key; Supplier Part Number 1: 296-26956-1-ND

## Sheet AIM2 - FTDI REVB.SchDoc: FTDI USB to UART Interface
size B; DrawnBy: DJW; DocumentNumber: 4; SheetNumber: 4; SheetTotal: 12
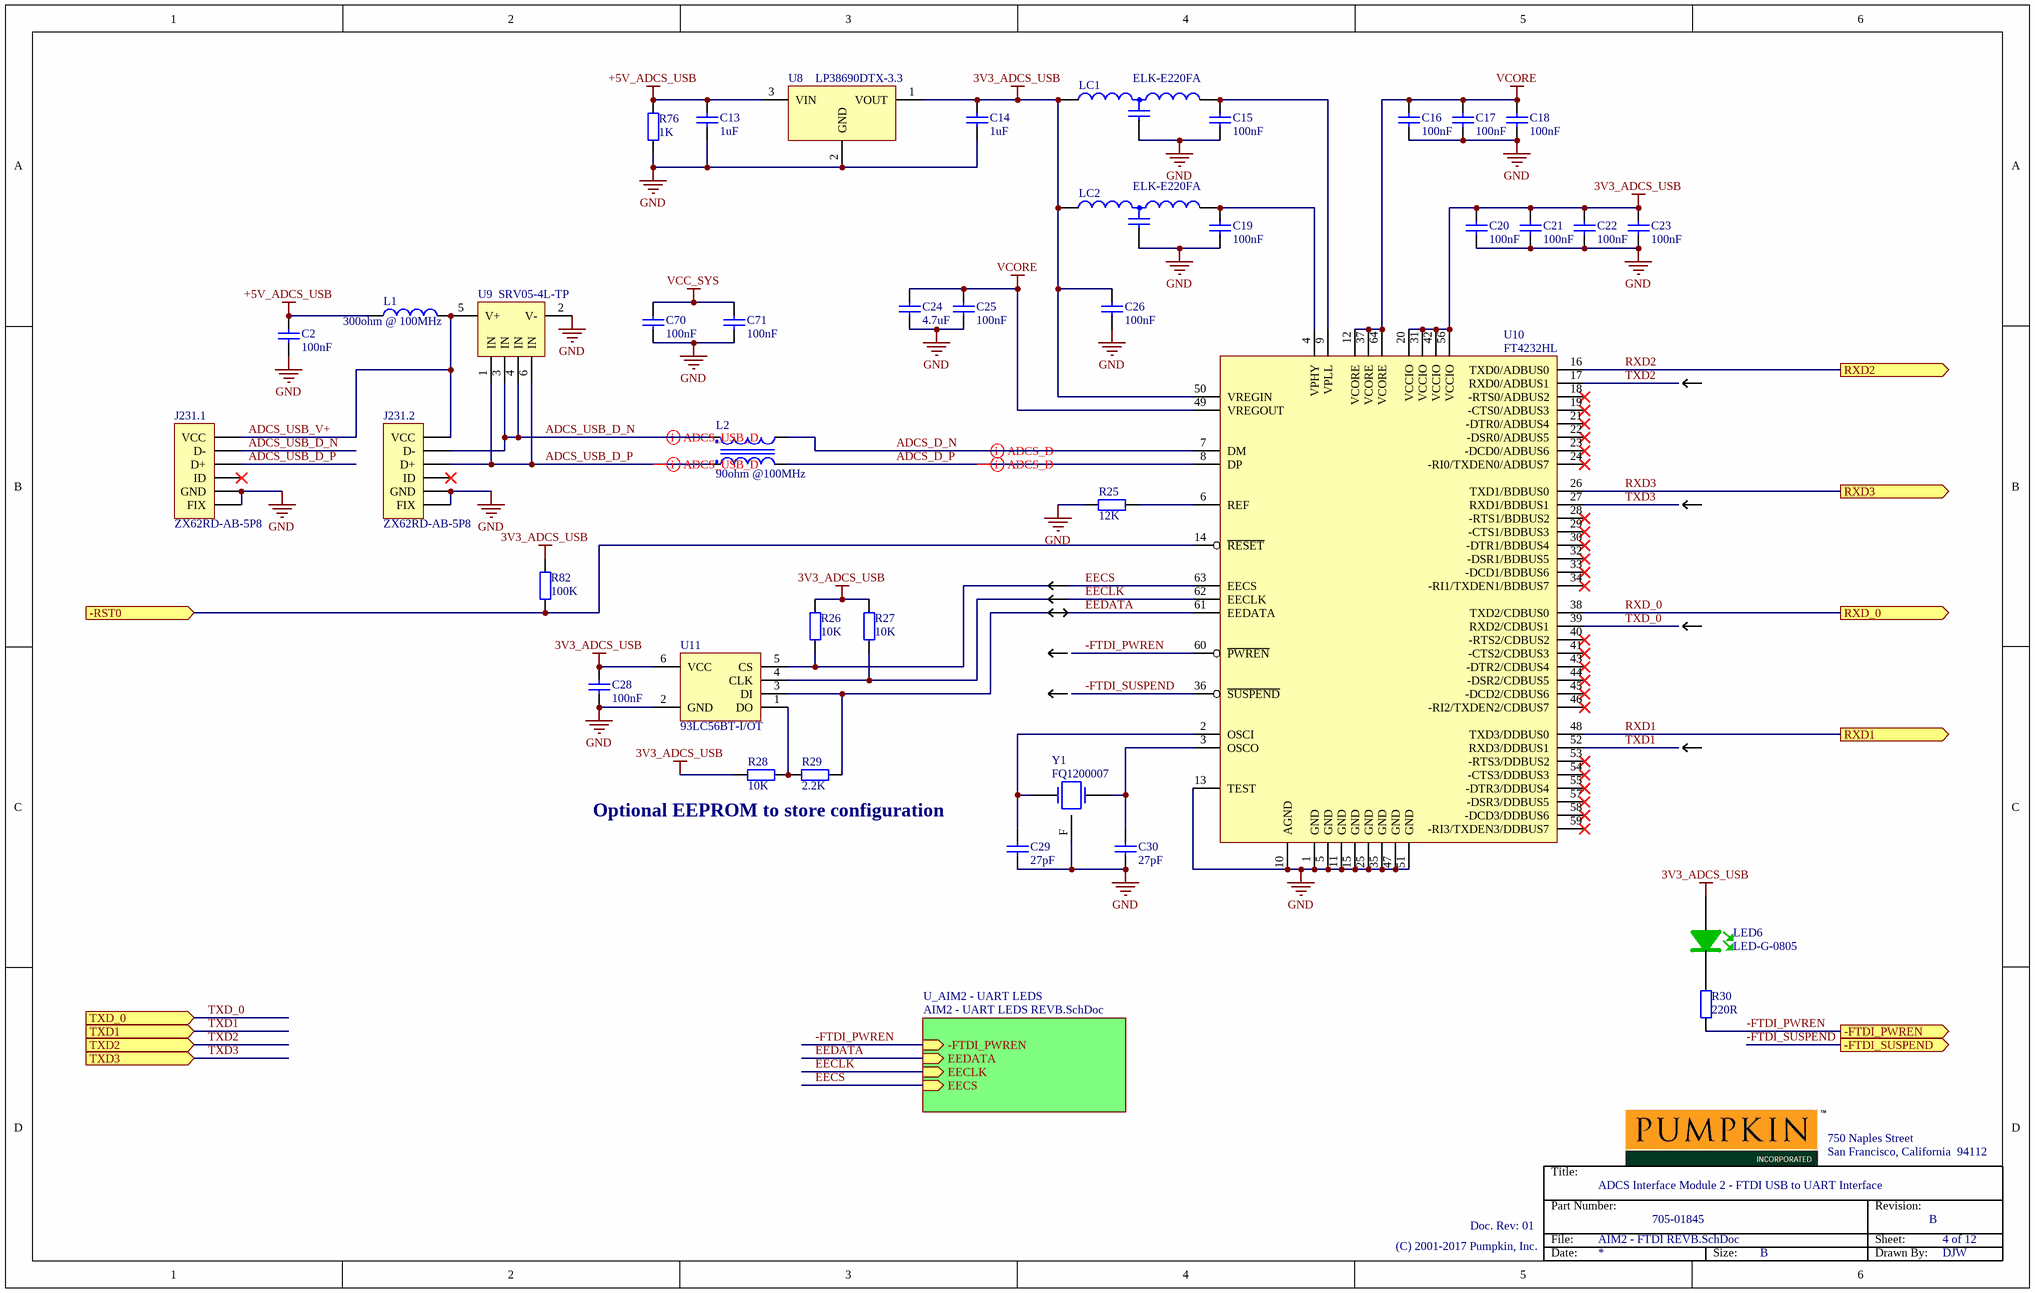
[diagram p3: AIM2 - FTDI REVB.SchDoc]

### Parts
C2  100nF  [0603 CAP]
C13  1uF  [0805 CAP]
C14  1uF  [0805 CAP]
C15  100nF  [0603 CAP]
C16  100nF  [0603 CAP]
C17  100nF  [0603 CAP]
C18  100nF  [0603 CAP]
C19  100nF  [0603 CAP]
C20  100nF  [0603 CAP]
C21  100nF  [0603 CAP]
C22  100nF  [0603 CAP]
C23  100nF  [0603 CAP]
C24  4.7uF  [0805 CAP]
C25  100nF  [0603 CAP]
C26  100nF  [0603 CAP]
C28  100nF  [0603 CAP]
C29  27pF  [0402 CAP]
C30  27pF  [0402 CAP]
C70  100nF  [0603 CAP]
C71  100nF  [0603 CAP]
J231.1  ZX62RD-AB-5P8  [SM$5C$ZX62RD-AB-5P8]
J231.2  ZX62RD-AB-5P8  [SM$5C$ZX62RD-AB-5P8]
L1  300ohm @ 100MHz  [0603 IND]
L2  90ohm @100MHz  [DFN250P320X200-4N]
LC1  ELK-E220FA  [ELK]
LC2  ELK-E220FA  [ELK]
LED6  LED-G-0805  [0805 LED-GREEN]
R25  12K  [0603 RES]
R26  10K  [0805 RES]
R27  10K  [0805 RES]
R28  10K  [0805 RES]
R29  2.2K  [0805 RES]
R30  220R  [0805 RES]
R76  1K  [0805 RES]
R82  100K  [0805 RES]
U8  LP38690DTX-3.3  [DPAK]
U9  SRV05-4L-TP  [SOT23-6]
U10  FT4232HL  [TSQFP50P1200X1200X120_HS-65N]
U11  93LC56BT-I/OT  [SOT23-6]
Y1  FQ1200007  [FQ Crystal]

### Sub-sheets
U_AIM2 - UART LEDS = AIM2 - UART LEDS REVB.SchDoc: -FTDI_PWREN (in), EEDATA (in), EECLK (in), EECS (in)

### Ports
-FTDI_PWREN (out), -FTDI_SUSPEND (out), -RST0 (in), RXD1 (out), RXD2 (out), RXD3 (out), RXD_0 (out), TXD1 (in), TXD2 (in), TXD3 (in), TXD_0 (in)

### Nets
3V3_ADCS_USB: C14.2 C20.2 C21.2 C22.2 C23.2 C26.2 C28.2 LC1.1 LC2.1 LED6.2 R26.2 R27.2 R28.1 R82.2 U8.1(VOUT) U10.20(VCCIO) U10.31(VCCIO) U10.42(VCCIO) U10.50(VREGIN) U10.56(VCCIO) U11.6(VCC)
+5V_ADCS_USB: C2.2 C13.2 L1.1 R76.2 U8.3(VIN)
GND: C2.1 C13.1 C14.1 C15.1 C16.1 C17.1 C18.1 C19.1 C20.1 C21.1 C22.1 C23.1 C24.1 C25.1 C26.1 C28.1 C29.1 C30.1 C70.1 C71.1 J231.1.5(GND) J231.1.F(FIX) J231.2.5(GND) J231.2.F(FIX) LC1.2 LC2.2 R25.1 R76.1 U8.2(GND) U9.2(V-) U10.1(GND) U10.5(GND) U10.10(AGND) U10.11(GND) U10.13(TEST) U10.15(GND) U10.25(GND) U10.35(GND) U10.47(GND) U10.51(GND) U11.2(GND) Y1.F
VCC_SYS: C70.2 C71.2
VCORE: C16.2 C17.2 C18.2 C24.2 C25.2 U10.12(VCORE) U10.37(VCORE) U10.49(VREGOUT) U10.64(VCORE)
-FTDI_PWREN: R30.1 U10.60(~{PWREN}) ; port -FTDI_PWREN, sheet U_AIM2 - UART LEDS/-FTDI_PWREN
-FTDI_SUSPEND: U10.36(~{SUSPEND}) ; port -FTDI_SUSPEND
-RST0: R82.1 U10.14(~{RESET}) ; port -RST0
ADCS_D_N: L2.3 U10.7(DM)
ADCS_D_P: L2.2 U10.8(DP)
ADCS_USB_D_N: J231.1.2(D-) J231.2.2(D-) L2.4 U9.3(IN) U9.4(IN)
ADCS_USB_D_P: J231.1.3(D+) J231.2.3(D+) L2.1 U9.1(IN) U9.6(IN)
ADCS_USB_V+: J231.1.1(VCC) J231.2.1(VCC) L1.2 U9.5(V+)
EECLK: R27.1 U10.62(EECLK) U11.4(CLK) ; sheet U_AIM2 - UART LEDS/EECLK
EECS: R26.1 U10.63(EECS) U11.5(CS) ; sheet U_AIM2 - UART LEDS/EECS
EEDATA: R29.2 U10.61(EEDATA) U11.3(DI) ; sheet U_AIM2 - UART LEDS/EEDATA
RXD1: U10.48(TXD3/DDBUS0) ; port RXD1
RXD2: U10.16(TXD0/ADBUS0) ; port RXD2
RXD3: U10.26(TXD1/BDBUS0) ; port RXD3
RXD_0: U10.38(TXD2/CDBUS0) ; port RXD_0
TXD1: U10.52(RXD3/DDBUS1) ; port TXD1
TXD2: U10.17(RXD0/ADBUS1) ; port TXD2
TXD3: U10.27(RXD1/BDBUS1) ; port TXD3
TXD_0: U10.39(RXD2/CDBUS1) ; port TXD_0
NetC15_2: C15.2 LC1.3 U10.9(VPLL)
NetC19_2: C19.2 LC2.3 U10.4(VPHY)
NetC29_2: C29.2 U10.2(OSCI) Y1.1
NetC30_2: C30.2 U10.3(OSCO) Y1.3
NetLED6_1: LED6.1 R30.2
NetR25_2: R25.2 U10.6(REF)
NetR28_2: R28.2 R29.1 U11.1(DO)

Not connected (* = marked no-connect by the designer): J231.1 4(ID)*; J231.2 4(ID)*; U10 18(-RTS0/ADBUS2)* 19(-CTS0/ADBUS3)* 21(-DTR0/ADBUS4)* 22(-DSR0/ADBUS5)* 23(-DCD0/ADBUS6)* 24(-RI0/TXDEN0/ADBUS7)* 28(-RTS1/BDBUS2)* 29(-CTS1/BDBUS3)* 30(-DTR1/BDBUS4)* 32(-DSR1/BDBUS5)* 33(-DCD1/BDBUS6)* 34(-RI1/TXDEN1/BDBUS7)* 40(-RTS2/CDBUS2)* 41(-CTS2/CDBUS3)* 43(-DTR2/CDBUS4)* 44(-DSR2/CDBUS5)* 45(-DCD2/CDBUS6)* 46(-RI2/TXDEN2/CDBUS7)* 53(-RTS3/DDBUS2)* 54(-CTS3/DDBUS3)* 55(-DTR3/DDBUS4)* 57(-DSR3/DDBUS5)* 58(-DCD3/DDBUS6)* 59(-RI3/TXDEN3/DDBUS7)*

### Layout directives
differential pair; rule Matched Net Lengths [Tolerance = 10mil]; net class Diff Pairs: ADCS_D_N, ADCS_D_P, ADCS_USB_D_N, ADCS_USB_D_P

### Notes on the sheet
- Optional EEPROM to store configuration
- Title:
- 750 Naples Street
- San Francisco, California  94112
- Doc. Rev: 01
- File:
- Part Number:
- Revision:
- Sheet:
- (C) 2001-2017 Pumpkin, Inc.
- Date:
- Size:
- B
- Drawn By:

### Library data of the parts
C2 C15-C23 C25 C26 C28 C70 C71 = Capacitor 100nF 0603: Capacitor 100nF 0603 X7R 50V 5%; Value: 100nF; Supplier 1: Digi-Key; Supplier Part Number 1: 399-7844-1-ND
C13 C14 = Capacitor 1uF 0805: Capacitor 1uF 0805 X7R 25V 10%; Value: 1uF; Supplier 1: Digi-Key; Supplier Part Number 1: 445-5687-1-ND
C24 = Capacitor 4.7uF 0805: Capacitor 4.7uF 0805 X7R 35V 10%; Value: 4.7uF; Supplier 1: Digi-Key; Supplier Part Number 1: 445-172479-1-ND
C29 C30 = Capacitor 27pF 0402: Capacitor 27pF 0402 NP0 50V 1%; Value: 27pF; Supplier 1: Digi-Key; Supplier Part Number 1: 490-6223-1-ND
J231.1 J231.2 = ZX62RD-AB-5P8: Header USB Micro AB; Supplier 1: Digi-Key; Supplier Part Number 1: H11611CT-ND
L1 = Ferrite Bead 300ohm @ 100MHz: Revision: July-2002: Re-released for DXP Platform.; Value: 300ohm @ 100MHz; Supplier 1: Digi-Key; Supplier Part Number 1: 732-1592-1-ND
L2 = Choke 90ohm @ 100MHz: Choke Common-mode 90ohm @ 100MHz; Supplier 1: Digi-Key; Supplier Part Number 1: 732-1469-1-ND
LC1 LC2 = LC Filter: Filter LC 100MHz; Supplier 1: Digi-Key; Supplier Part Number 1: P9871DKR-ND
LED6 = LED GREEN 0805: Supplier 1: Digi-Key; Supplier Part Number 1: 160-1414-1-ND
R25 = Resistor 12K 0603: Resistor 12K 0603 0.1W 1%; Revision: Altium ETH 11-03.2008; Value: 12K; Supplier 1: Digi-Key; Supplier Part Number 1: P12.0KHCT-ND
R26-R28 = Resistor 10K 0805: Resistor 10K 0805 0.125W 1%; Revision: Altium ETH 11-03.2008; Supplier 1: Digi-Key; Supplier Part Number 1: 311-10.0KCRCT-ND; Value: 10K
R29 = Resistor 2K2 0805: Resistor 2.2K 0805 0.125W 1%; Revision: Altium ETH 11-03.2008; Value: 2.2K; Supplier 1: Digi-Key; Supplier Part Number 1: 311-2.20KCRCT-ND
R30 = Resistor 220R 0805: Resistor 220R 0805 0.125W 1%; Revision: Altium ETH 11-03.2008; Value: 220R; Supplier 1: Digi-Key; Supplier Part Number 1: P220CCT-ND
R76 = Resistor 1K 0805: Resistor 1K 0805 0.125W 1%; Revision: Altium ETH 11-03.2008; Value: 1K; Supplier 1: Digi-Key; Supplier Part Number 1: P1.00KCCT-ND
R82 = Resistor 100K 0805: Resistor 100K 0805 0.5W 1%; Revision: Altium ETH 11-03.2008; Value: 100K; Supplier 1: Digi-Key; Supplier Part Number 1: P16060CT-ND
U8 = LP38690DTX-3.3: Regulator 3.3V LDO; Supplier 1: Digi-Key; Supplier Part Number 1: LP38690DTX-3.3/NOPBCT-ND
U9 = SRV05-4L-TP: IC ESD protection 4 input; Supplier 1: Digi-Key; Supplier Part Number 1: SRV05-4L-TPMSCT-ND
U10 = FT4232HL: IC FTDI 4 port controller; Supplier 1: Digi-Key; Supplier Part Number 1: 768-1026-1-ND
U11 = 93LC56BT-I/OT: IC Memory EEPROM 2Kbit; Supplier 1: Digi-Key; Supplier Part Number 1: 93LC56BT-I/OTCT-ND
Y1 = FQ1200007: Crystal 12MHz; Supplier 1: Digi-Key; Supplier Part Number 1: FQ1200007CT-ND

## Sheet AIM2 - UART LEDS REVB.SchDoc
size B; DrawnBy: DJW; DocumentNumber: 5; SheetNumber: 5; SheetTotal: 12
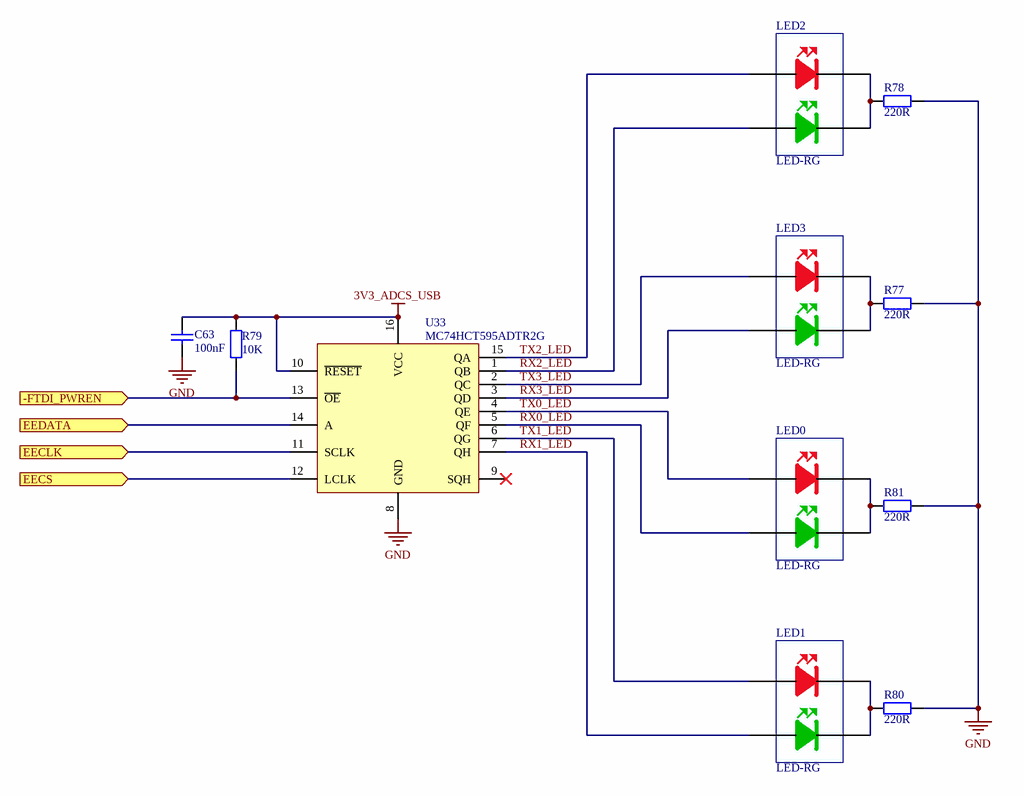
[diagram p4: AIM2 - UART LEDS REVB.SchDoc]

### Parts
C63  100nF  [0603 CAP]
LED0  LED-RG  [LED SMT RG]
LED1  LED-RG  [LED SMT RG]
LED2  LED-RG  [LED SMT RG]
LED3  LED-RG  [LED SMT RG]
R77  220R  [0805 RES]
R78  220R  [0805 RES]
R79  10K  [0805 RES]
R80  220R  [0805 RES]
R81  220R  [0805 RES]
U33  MC74HCT595ADTR2G  [TSOP-16]

### Ports
-FTDI_PWREN (in), EECLK (in), EECS (in), EEDATA (in)

### Nets
3V3_ADCS_USB: C63.2 R79.2 U33.10(~{RESET}) U33.16(VCC)
GND: C63.1 R77.2 R78.2 R80.2 R81.2 U33.8(GND)
-FTDI_PWREN: R79.1 U33.13(~{OE}) ; port -FTDI_PWREN
EECLK: U33.11(SCLK) ; port EECLK
EECS: U33.12(LCLK) ; port EECS
EEDATA: U33.14(A) ; port EEDATA
RX0_LED: LED0.4 U33.5(QF)
RX1_LED: LED1.4 U33.7(QH)
RX2_LED: LED2.4 U33.1(QB)
RX3_LED: LED3.4 U33.3(QD)
TX0_LED: LED0.1 U33.4(QE)
TX1_LED: LED1.1 U33.6(QG)
TX2_LED: LED2.1 U33.15(QA)
TX3_LED: LED3.1 U33.2(QC)
NetLED0_2: LED0.2 LED0.3 R81.1
NetLED1_2: LED1.2 LED1.3 R80.1
NetLED2_2: LED2.2 LED2.3 R78.1
NetLED3_2: LED3.2 LED3.3 R77.1

Not connected (* = marked no-connect by the designer): U33 9(SQH)*

### Notes on the sheet
- Title:
- 750 Naples Street
- San Francisco, California  94112
- Doc. Rev: 01
- File:
- Part Number:
- Revision:
- Sheet:
- (C) 2001-2017 Pumpkin, Inc.
- Date:
- Size:
- B
- Drawn By:

### Library data of the parts
C63 = Capacitor 100nF 0603: Capacitor 100nF 0603 X7R 50V 5%; Value: 100nF; Supplier 1: Digi-Key; Supplier Part Number 1: 399-7844-1-ND
LED0-LED3 = LED RED/GREEN 0805: LED Red, Green 0805; Supplier 1: Digi-Key; Supplier Part Number 1: 754-1093-1-ND
R77 R78 R80 R81 = Resistor 220R 0805: Resistor 220R 0805 0.125W 1%; Revision: Altium ETH 11-03.2008; Value: 220R; Supplier 1: Digi-Key; Supplier Part Number 1: P220CCT-ND
R79 = Resistor 10K 0805: Resistor 10K 0805 0.125W 1%; Revision: Altium ETH 11-03.2008; Supplier 1: Digi-Key; Supplier Part Number 1: 311-10.0KCRCT-ND; Value: 10K
U33 = MC74HCT595ADTR2G: IC Shift Register; Supplier 1: Digi-Key; Supplier Part Number 1: MC74HCT595ADTR2GOSCT-ND

## Sheet AIM2 - ADCS Multiplexing REVB.SchDoc: ADCS UART Multiplexing
size B; DrawnBy: DJW; DocumentNumber: 2; SheetNumber: 2; SheetTotal: 12
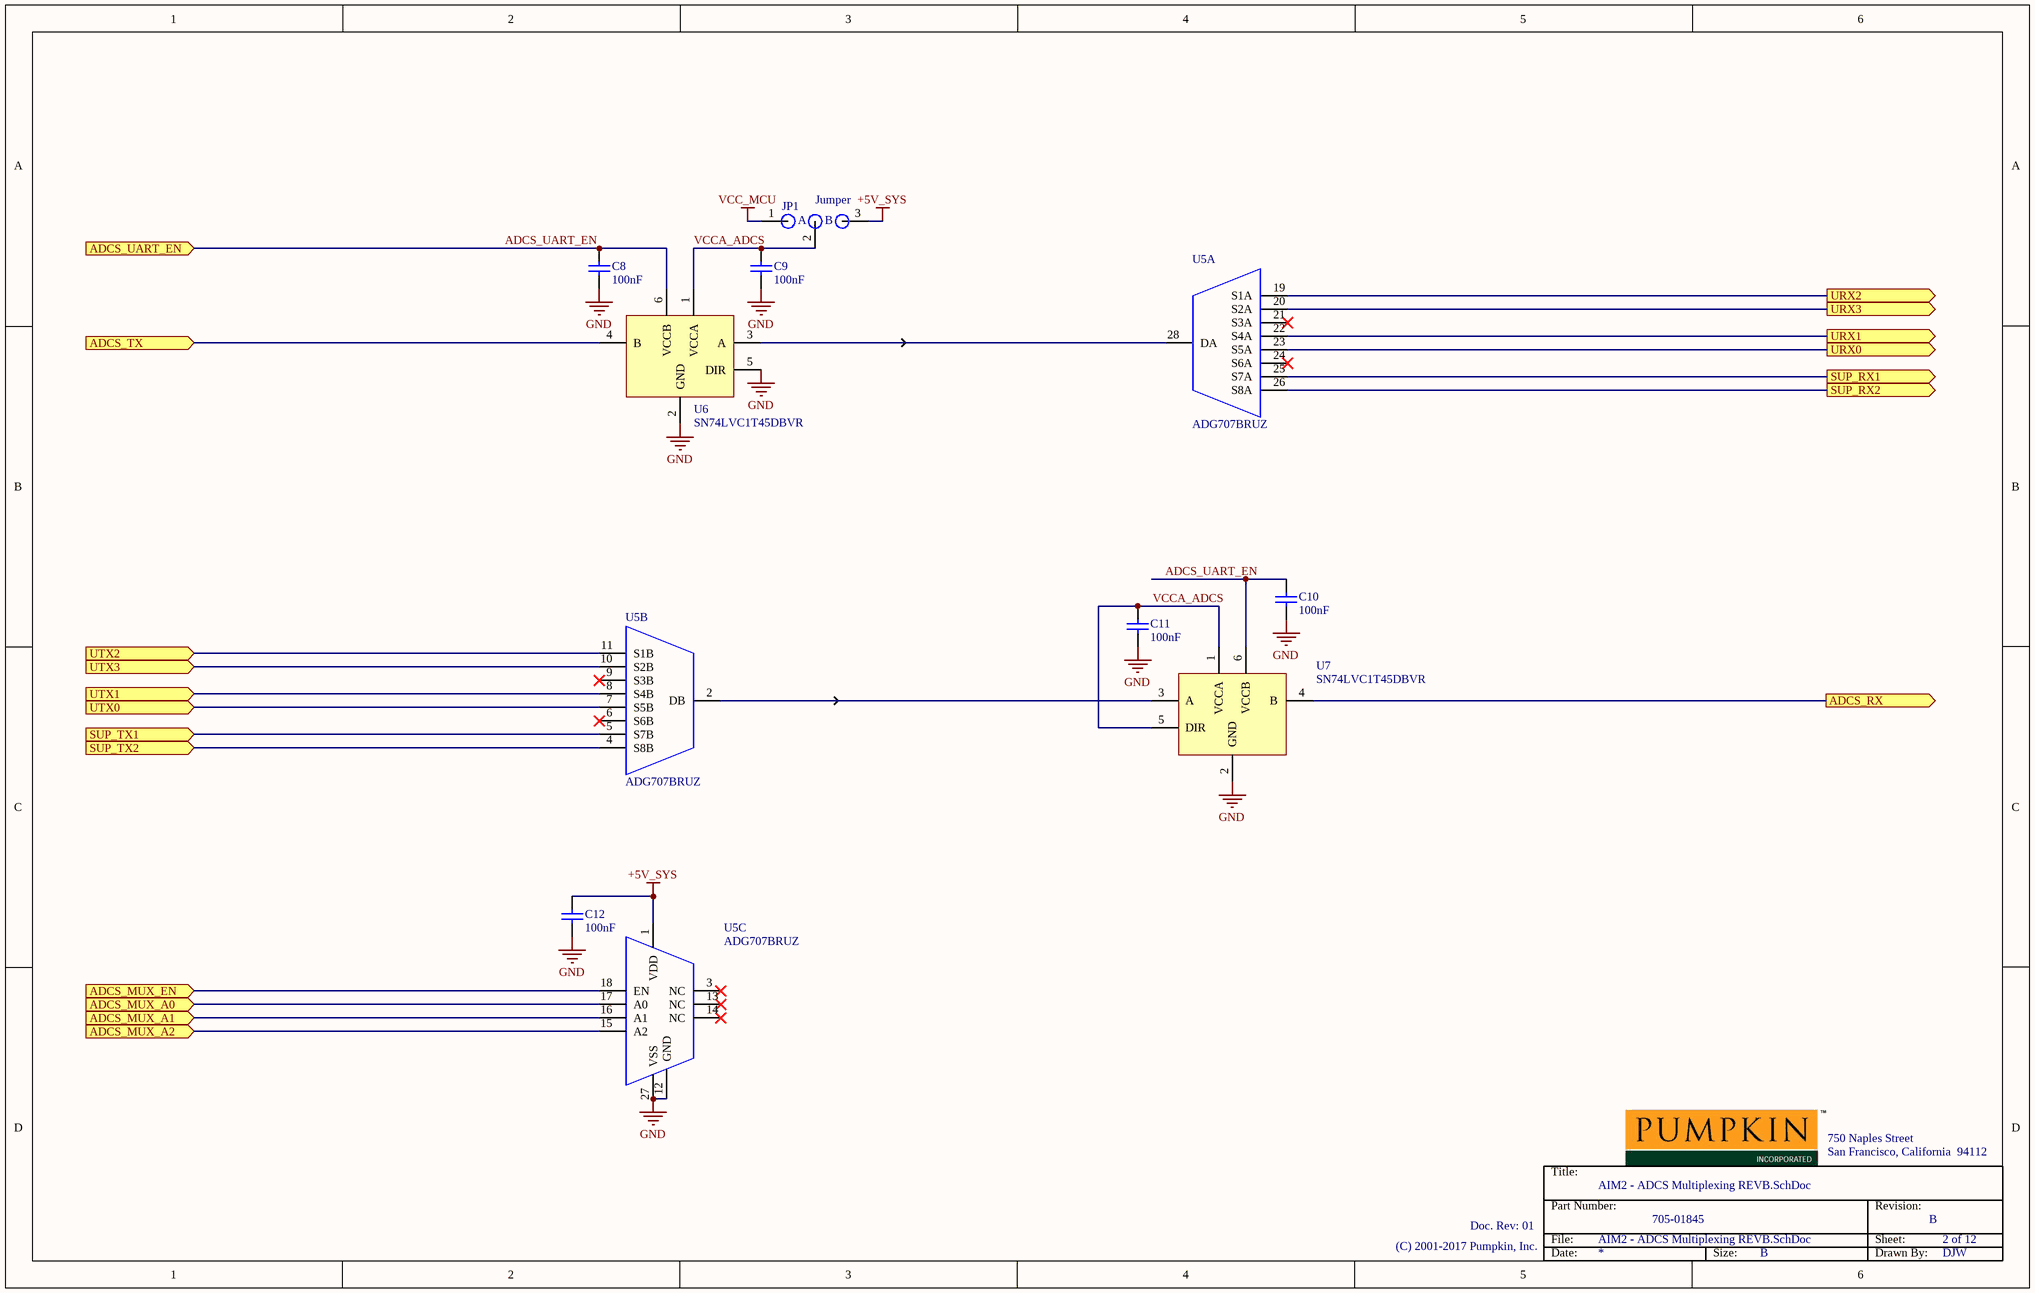
[diagram p5: AIM2 - ADCS Multiplexing REVB.SchDoc]

### Parts
C8  100nF  [0603 CAP]
C9  100nF  [0603 CAP]
C10  100nF  [0603 CAP]
C11  100nF  [0603 CAP]
C12  100nF  [0603 CAP]
JP1  Jumper  [0805 RES 2 way jumper - 1]
U5  ADG707BRUZ  [28-TSSOP]  (parts A,B,C of 3)
U6  SN74LVC1T45DBVR  [SOT23-6]
U7  SN74LVC1T45DBVR  [SOT23-6]

### Ports
ADCS_MUX_A0 (in), ADCS_MUX_A1 (in), ADCS_MUX_A2 (in), ADCS_MUX_EN (in), ADCS_RX (out), ADCS_TX (in), ADCS_UART_EN (in), SUP_RX1 (out), SUP_RX2 (out), SUP_TX1 (in), SUP_TX2 (in), URX0 (out), URX1 (out), URX2 (out), URX3 (out), UTX0 (in), UTX1 (in), UTX2 (in), UTX3 (in)

### Nets
+5V_SYS: C12.2 JP1.3 U5.1(VDD)
GND: C8.1 C9.1 C10.1 C11.1 C12.1 U5.12(GND) U5.27(VSS) U6.2(GND) U6.5(DIR) U7.2(GND)
VCC_MCU: JP1.1
ADCS_MUX_A0: U5.17(A0) ; port ADCS_MUX_A0
ADCS_MUX_A1: U5.16(A1) ; port ADCS_MUX_A1
ADCS_MUX_A2: U5.15(A2) ; port ADCS_MUX_A2
ADCS_MUX_EN: U5.18(EN) ; port ADCS_MUX_EN
ADCS_RX: U7.4(B) ; port ADCS_RX
ADCS_TX: U6.4(B) ; port ADCS_TX
ADCS_UART_EN: C8.2 C10.2 U6.6(VCCB) U7.6(VCCB) ; port ADCS_UART_EN
SUP_RX1: U5.25(S7A) ; port SUP_RX1
SUP_RX2: U5.26(S8A) ; port SUP_RX2
SUP_TX1: U5.5(S7B) ; port SUP_TX1
SUP_TX2: U5.4(S8B) ; port SUP_TX2
URX0: U5.23(S5A) ; port URX0
URX1: U5.22(S4A) ; port URX1
URX2: U5.19(S1A) ; port URX2
URX3: U5.20(S2A) ; port URX3
UTX0: U5.7(S5B) ; port UTX0
UTX1: U5.8(S4B) ; port UTX1
UTX2: U5.11(S1B) ; port UTX2
UTX3: U5.10(S2B) ; port UTX3
VCCA_ADCS: C9.2 C11.2 JP1.2 U6.1(VCCA) U7.1(VCCA) U7.5(DIR)
NetU5_2: U5.2(DB) U7.3(A)
NetU5_28: U5.28(DA) U6.3(A)

Not connected (* = marked no-connect by the designer): U5 3(NC)* 6(S6B)* 9(S3B)* 13(NC)* 14(NC)* 21(S3A)* 24(S6A)*

### Notes on the sheet
- Title:
- 750 Naples Street
- San Francisco, California  94112
- Doc. Rev: 01
- File:
- Part Number:
- Revision:
- Sheet:
- (C) 2001-2017 Pumpkin, Inc.
- Date:
- Size:
- B
- Drawn By:
- (in symbol Jumper 2 way 0805) A; B

### Library data of the parts
C8-C12 = Capacitor 100nF 0603: Capacitor 100nF 0603 X7R 50V 5%; Value: 100nF; Supplier 1: Digi-Key; Supplier Part Number 1: 399-7844-1-ND
JP1 = Jumper 2 way 0805: Jumper 0805 2 pos; Supplier 1: Digi-Key; Supplier Part Number 1: P0.0ACT-ND
U5 = ADG707BRUZ: IC Multiplexer 2x 8:1; Supplier 1: Digi-Key; Supplier Part Number 1: ADG707BRUZ-ND
U6 U7 = SN74LVC1T45DBVR: IC Logic Isolator 1 channel; Supplier 1: Digi-Key; Supplier Part Number 1: 296-16843-1-ND

## Sheet AIM2 - Bus Interface REVB.SchDoc: Bus Interface
size B; DrawnBy: DJW; DocumentNumber: 6; SheetNumber: 6; SheetTotal: 12
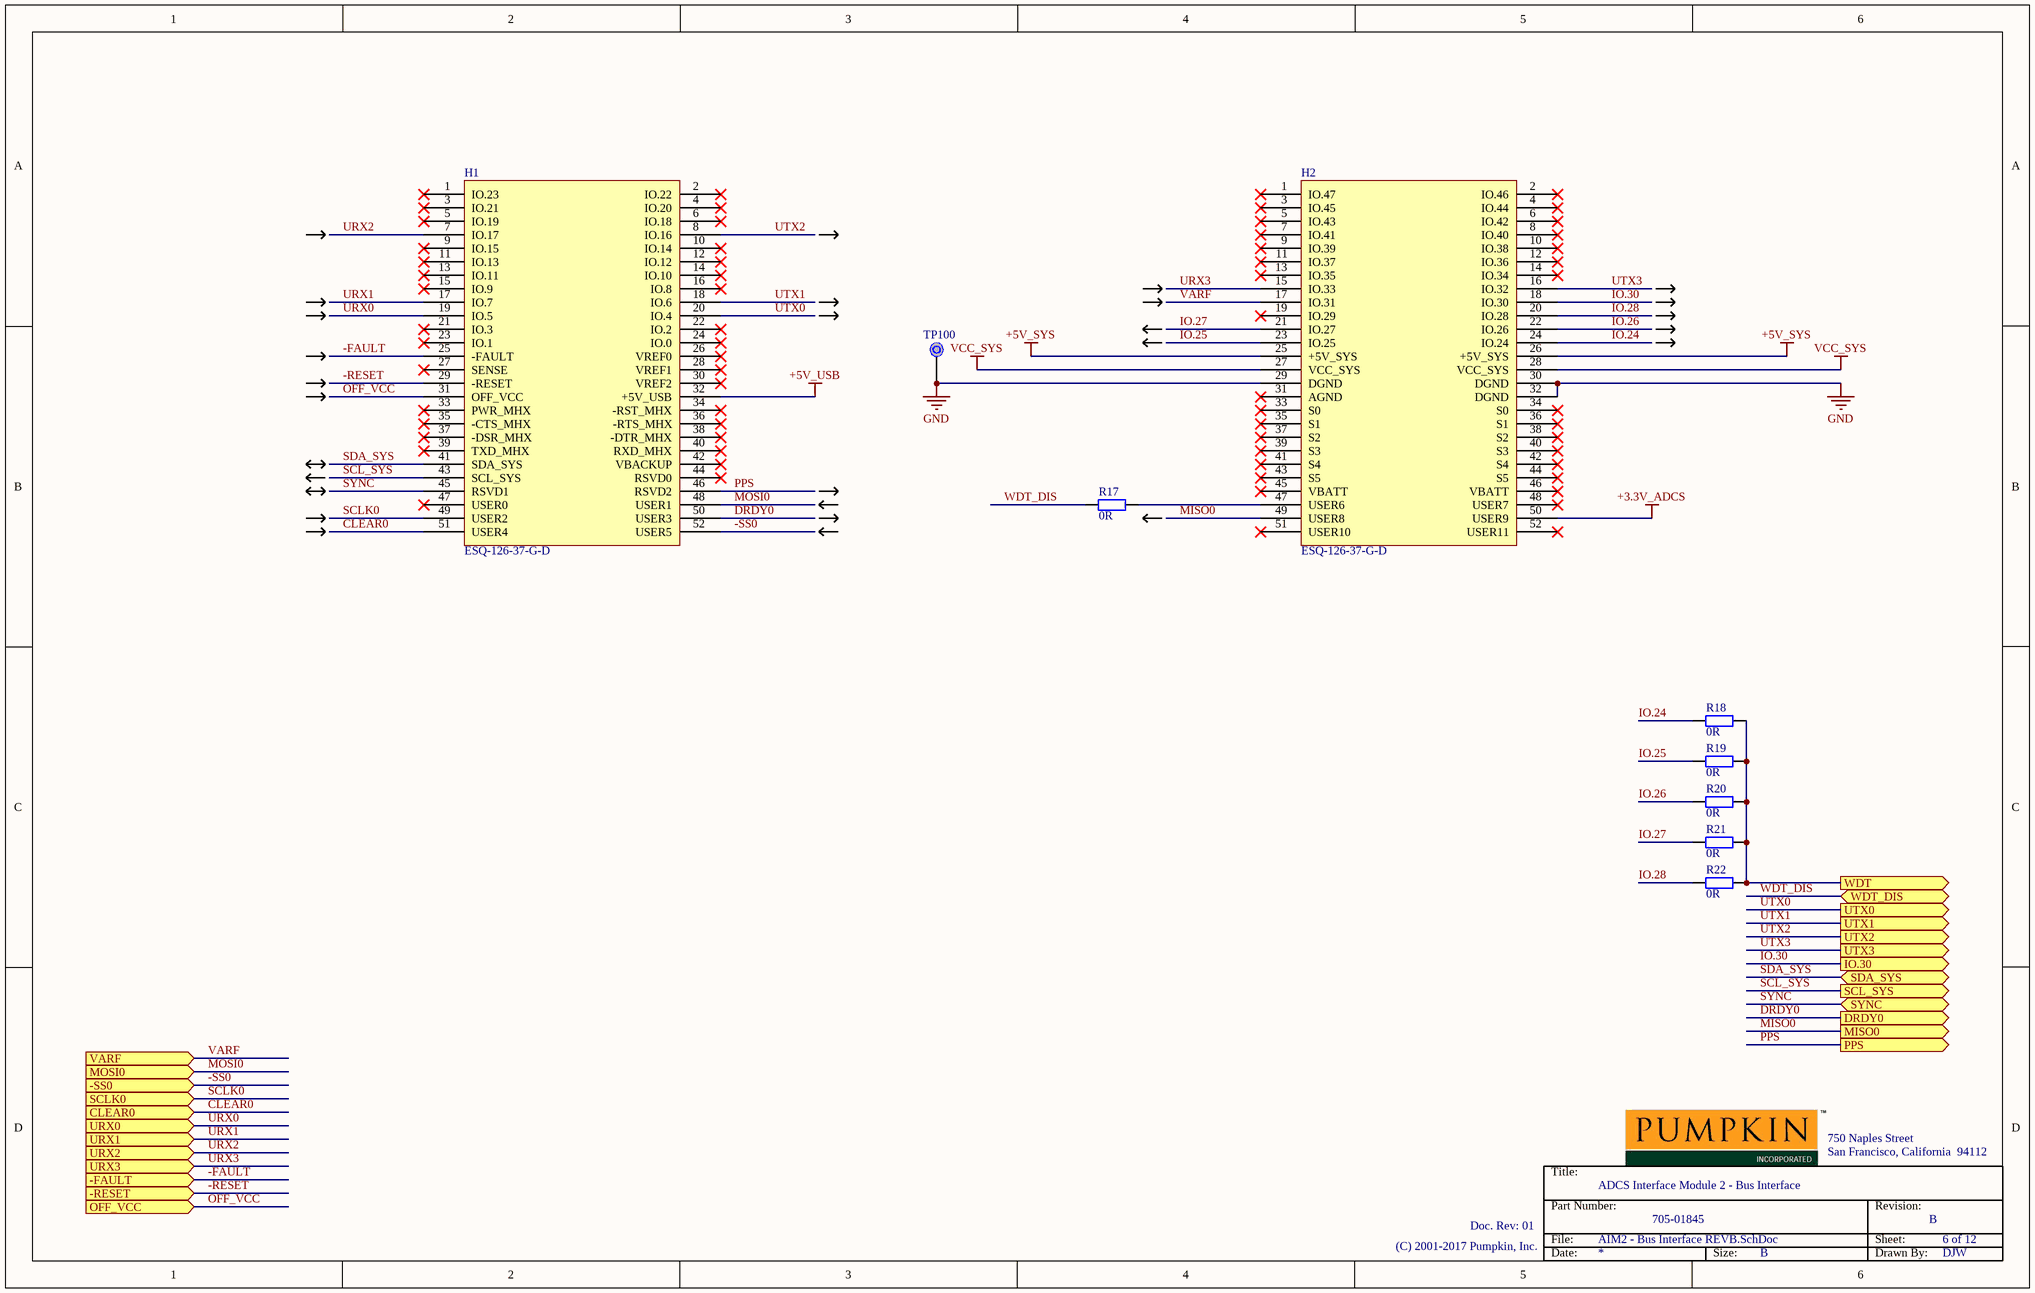
[diagram p6: AIM2 - Bus Interface REVB.SchDoc]

### Parts
H1  ESQ-126-37-G-D  [ESQ-126-37-G-D]
H2  ESQ-126-37-G-D  [ESQ-126-37-G-D]
R17  0R  [0805 RES - DNP]
R18  0R  [0805 RES - DNP]
R19  0R  [0805 RES - DNP]
R20  0R  [0805 RES - DNP]
R21  0R  [0805 RES - DNP]
R22  0R  [0805 RES - DNP]
TP100  GND Testpoint  [GND Testpoint]  (value not drawn)  (no BOM)

### Ports
-FAULT (in), -RESET (in), -SS0 (in), CLEAR0 (in), DRDY0 (out), IO.30 (out), MISO0 (out), MOSI0 (in), OFF_VCC (in), PPS (out), SCL_SYS (out), SCLK0 (in), SDA_SYS (bidir), SYNC (bidir), URX0 (in), URX1 (in), URX2 (in), URX3 (in), UTX0 (out), UTX1 (out), UTX2 (out), UTX3 (out), VARF (in), WDT (out), WDT_DIS (bidir)

### Nets
+3.3V_ADCS: H2.50(USER9)
+5V_SYS: H2.25(+5V_SYS) H2.26(+5V_SYS)
+5V_USB: H1.32(+5V_USB)
GND: H2.29(DGND) H2.30(DGND) H2.32(DGND) TP100.1
VCC_SYS: H2.27(VCC_SYS) H2.28(VCC_SYS)
-FAULT: H1.25(-FAULT) ; port -FAULT
-RESET: H1.29(-RESET) ; port -RESET
-SS0: H1.52(USER5) ; port -SS0
CLEAR0: H1.51(USER4) ; port CLEAR0
DRDY0: H1.50(USER3) ; port DRDY0
IO.24: H2.24(IO.24) R18.1
IO.25: H2.23(IO.25) R19.1
IO.26: H2.22(IO.26) R20.1
IO.27: H2.21(IO.27) R21.1
IO.28: H2.20(IO.28) R22.1
IO.30: H2.18(IO.30) ; port IO.30
MISO0: H2.49(USER8) ; port MISO0
MOSI0: H1.48(USER1) ; port MOSI0
OFF_VCC: H1.31(OFF_VCC) ; port OFF_VCC
PPS: H1.46(RSVD2) ; port PPS
SCL_SYS: H1.43(SCL_SYS) ; port SCL_SYS
SCLK0: H1.49(USER2) ; port SCLK0
SDA_SYS: H1.41(SDA_SYS) ; port SDA_SYS
SYNC: H1.45(RSVD1) ; port SYNC
URX0: H1.19(IO.5) ; port URX0
URX1: H1.17(IO.7) ; port URX1
URX2: H1.7(IO.17) ; port URX2
URX3: H2.15(IO.33) ; port URX3
UTX0: H1.20(IO.4) ; port UTX0
UTX1: H1.18(IO.6) ; port UTX1
UTX2: H1.8(IO.16) ; port UTX2
UTX3: H2.16(IO.32) ; port UTX3
VARF: H2.17(IO.31) ; port VARF
WDT: R18.2 R19.2 R20.2 R21.2 R22.2 ; port WDT
WDT_DIS: R17.1 ; port WDT_DIS
NetH2_47: H2.47(USER6) R17.2

Not connected (* = marked no-connect by the designer): H1 1(IO.23)* 2(IO.22)* 3(IO.21)* 4(IO.20)* 5(IO.19)* 6(IO.18)* 9(IO.15)* 10(IO.14)* 11(IO.13)* 12(IO.12)* 13(IO.11)* 14(IO.10)* 15(IO.9)* 16(IO.8)* 21(IO.3)* 22(IO.2)* 23(IO.1)* 24(IO.0)* 26(VREF0)* 27(SENSE)* 28(VREF1)* 30(VREF2)* 33(PWR_MHX)* 34(-RST_MHX)* 35(-CTS_MHX)* 36(-RTS_MHX)* 37(-DSR_MHX)* 38(-DTR_MHX)* 39(TXD_MHX)* 40(RXD_MHX)* 42(VBACKUP)* 44(RSVD0)* 47(USER0)*; H2 1(IO.47)* 2(IO.46)* 3(IO.45)* 4(IO.44)* 5(IO.43)* 6(IO.42)* 7(IO.41)* 8(IO.40)* 9(IO.39)* 10(IO.38)* 11(IO.37)* 12(IO.36)* 13(IO.35)* 14(IO.34)* 19(IO.29)* 31(AGND)* 33(S0)* 34(S0)* 35(S1)* 36(S1)* 37(S2)* 38(S2)* 39(S3)* 40(S3)* 41(S4)* 42(S4)* 43(S5)* 44(S5)* 45(VBATT)* 46(VBATT)* 48(USER7)* 51(USER10)* 52(USER11)*

### Notes on the sheet
- Title:
- 750 Naples Street
- San Francisco, California  94112
- Doc. Rev: 01
- File:
- Part Number:
- Revision:
- Sheet:
- (C) 2001-2017 Pumpkin, Inc.
- Date:
- Size:
- B
- Drawn By:

### Library data of the parts
H1 = CubesatBus-H1 ESQ-126-37-G-D: Header PC/104 52-pin; Supplier 1: Digi-Key; Supplier Part Number 1: SAM9323-ND
H2 = CubesatBus-H2 ESQ-126-37-G-D: Header PC/104 52-pin; Supplier 1: Digi-Key; Supplier Part Number 1: SAM9323-ND
R17-R22 = Resistor 0R 0805: Resistor 0R 0805 0.125W; Revision: Altium ETH 11-03.2008; Value: 0R; Supplier 1: Digi-Key; Supplier Part Number 1: P0.0ACT-ND
TP100 = GND Testpoint: Testpoint GND

## Sheet AIM2 - External Interfaces REVB.SchDoc: External Interfaces
size B; DrawnBy: DJW; DocumentNumber: 7; SheetNumber: 7; SheetTotal: 12
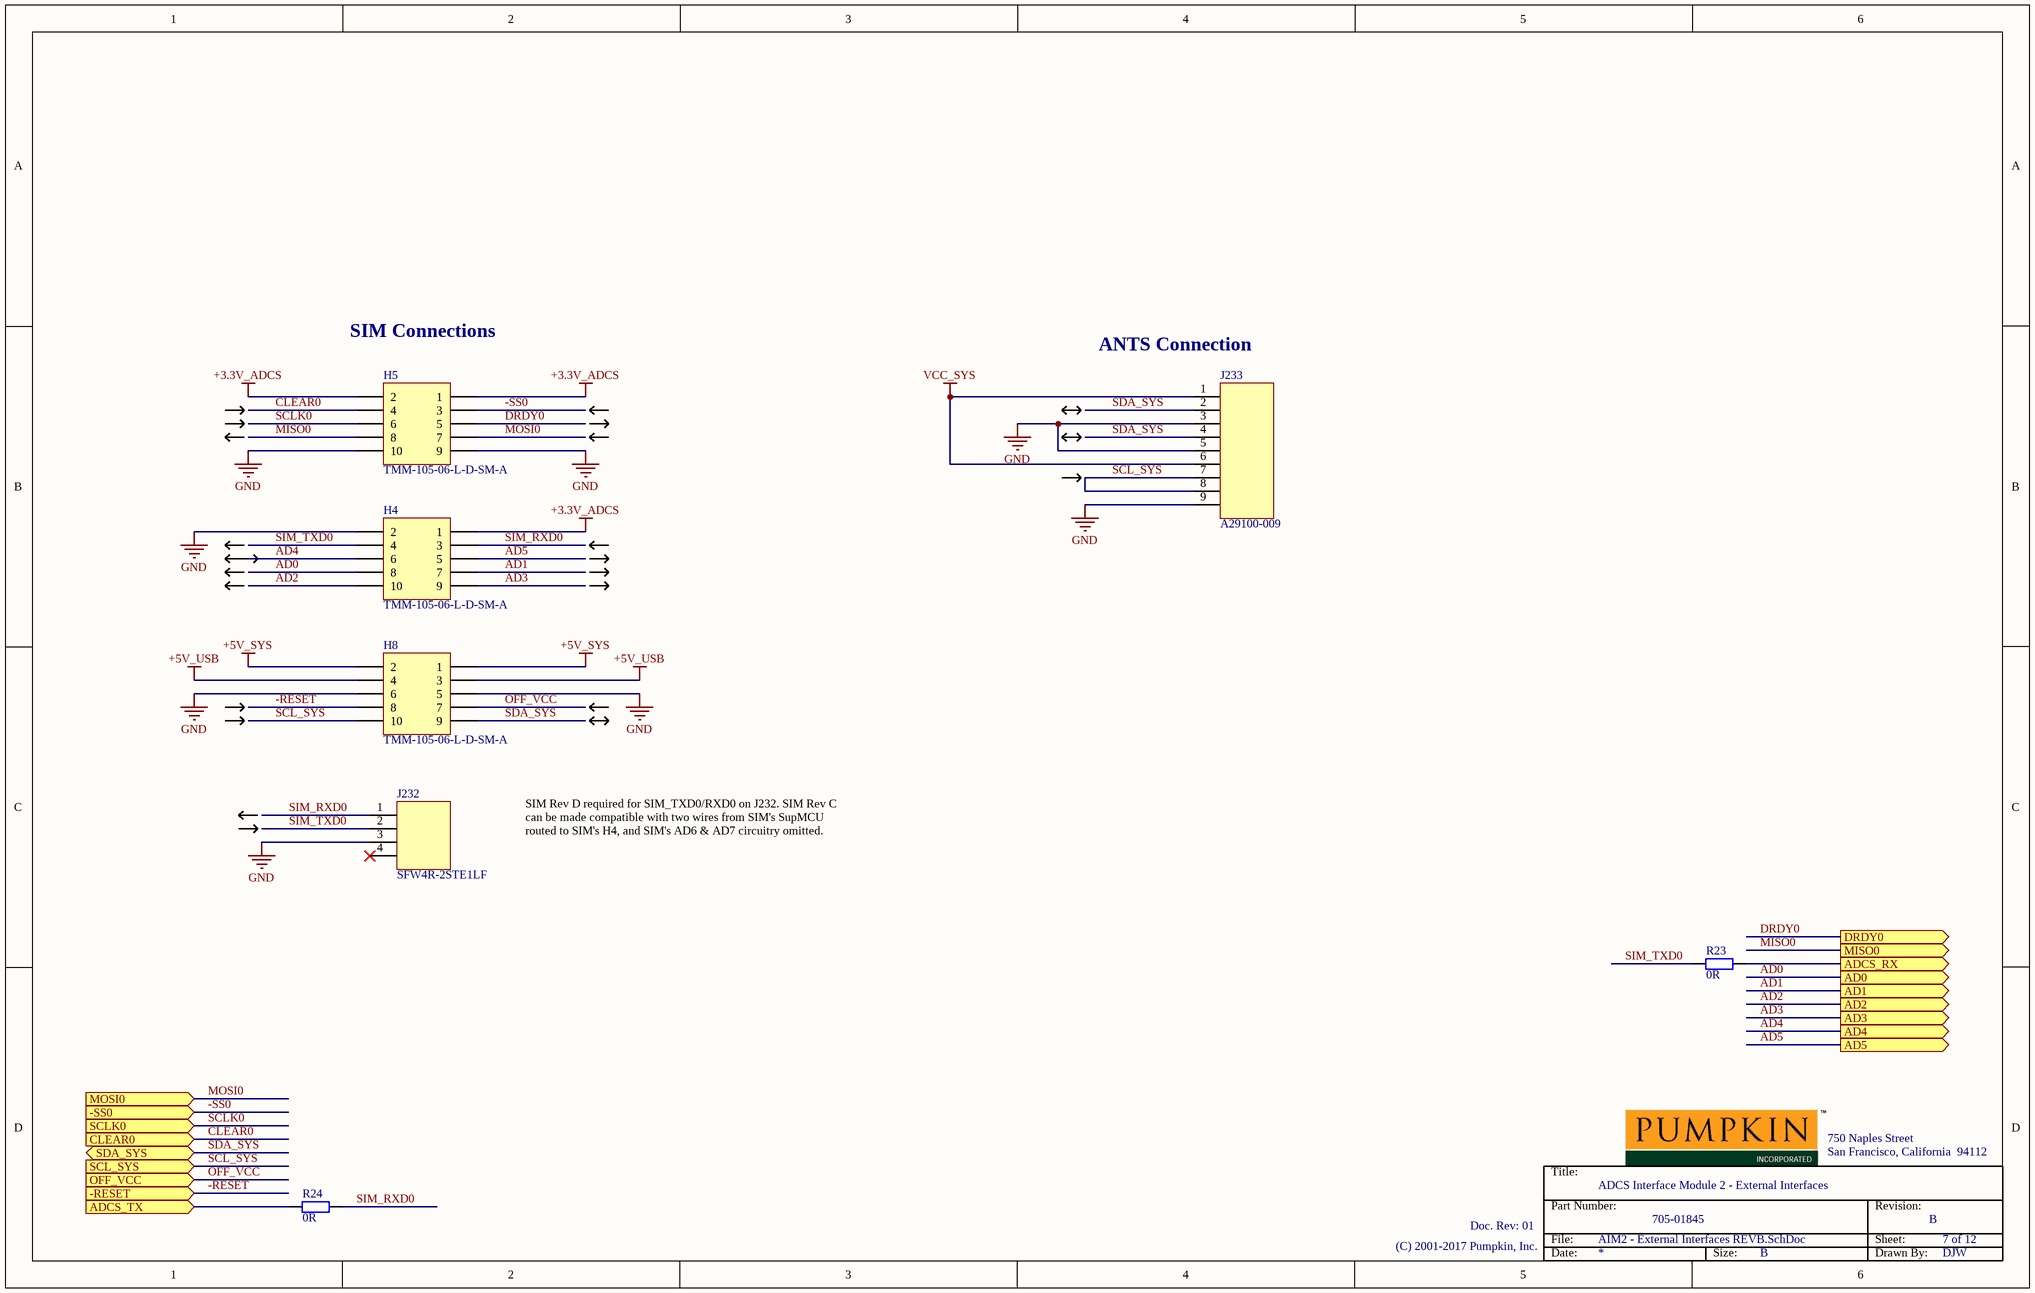
[diagram p7: AIM2 - External Interfaces REVB.SchDoc]

### Parts
H4  TMM-105-06-L-D-SM-A  [TMM-105-06-G-D-SM]
H5  TMM-105-06-L-D-SM-A  [TMM-105-06-G-D-SM]
H8  TMM-105-06-L-D-SM-A  [TMM-105-06-G-D-SM]
J232  SFW4R-2STE1LF  [SFW4R-2STE1LF]
J233  A29100-009  [A29100-009]
R23  0R  [0805 RES]
R24  0R  [0805 RES]

### Ports
-RESET (in), -SS0 (in), AD0 (out), AD1 (out), AD2 (out), AD3 (out), AD4 (out), AD5 (out), ADCS_RX (out), ADCS_TX (in), CLEAR0 (in), DRDY0 (out), MISO0 (out), MOSI0 (in), OFF_VCC (in), SCL_SYS (in), SCLK0 (in), SDA_SYS (bidir)

### Nets
+3.3V_ADCS: H4.1 H5.1 H5.2
+5V_SYS: H8.1 H8.2
+5V_USB: H8.3 H8.4
GND: H4.2 H5.9 H5.10 H8.5 H8.6 J232.3 J232.F J233.3 J233.5 J233.9 J233.F
VCC_SYS: J233.1 J233.6
-RESET: H8.8 ; port -RESET
-SS0: H5.3 ; port -SS0
AD0: H4.8 ; port AD0
AD1: H4.7 ; port AD1
AD2: H4.10 ; port AD2
AD3: H4.9 ; port AD3
AD4: H4.6 ; port AD4
AD5: H4.5 ; port AD5
ADCS_RX: R23.2 ; port ADCS_RX
ADCS_TX: R24.1 ; port ADCS_TX
CLEAR0: H5.4 ; port CLEAR0
DRDY0: H5.5 ; port DRDY0
MISO0: H5.8 ; port MISO0
MOSI0: H5.7 ; port MOSI0
OFF_VCC: H8.7 ; port OFF_VCC
SCL_SYS: H8.10 J233.7 J233.8 ; port SCL_SYS
SCLK0: H5.6 ; port SCLK0
SDA_SYS: H8.9 J233.2 J233.4 ; port SDA_SYS
SIM_RXD0: H4.3 J232.1 R24.2
SIM_TXD0: H4.4 J232.2 R23.1

Not connected (* = marked no-connect by the designer): J232 4(1)*

### Notes on the sheet
- SIM Connections
- (near J233) ANTS Connection
- SIM Rev D required for SIM_TXD0/RXD0 on J232. SIM Rev C can be made compatible with two wires from SIM's SupMCU routed to SIM's H4, and SIM's AD6 & AD7 circuitry omitted.
- Title:
- 750 Naples Street
- San Francisco, California  94112
- Doc. Rev: 01
- File:
- Part Number:
- Revision:
- Sheet:
- (C) 2001-2017 Pumpkin, Inc.
- Date:
- Size:
- B
- Drawn By:

### Library data of the parts
H4 H5 H8 = 5x2 2mm Header: Header 5x2 TH 2mm pitch; Supplier 1: Digi-Key; Supplier Part Number 1: SAM12979-ND
J232 = SFW4R-2STE1LF: Header Flex Connector 4 pin, top side; Supplier 1: Digi-Key; Supplier Part Number 1: 609-1884-1-ND
J233 = A29100-009: Header Omnetics A29100-009; Manufacturer 1: Omnetics; Manufacturer Part Number 1: A29100-009
R23 R24 = Resistor 0R 0805: Resistor 0R 0805 0.125W; Revision: Altium ETH 11-03.2008; Value: 0R; Supplier 1: Digi-Key; Supplier Part Number 1: P0.0ACT-ND

## Sheet AIM2 - GPS REVB.SchDoc: OEM716 Interface
size B; DrawnBy: DJW; DocumentNumber: 9; SheetNumber: 9; SheetTotal: 12
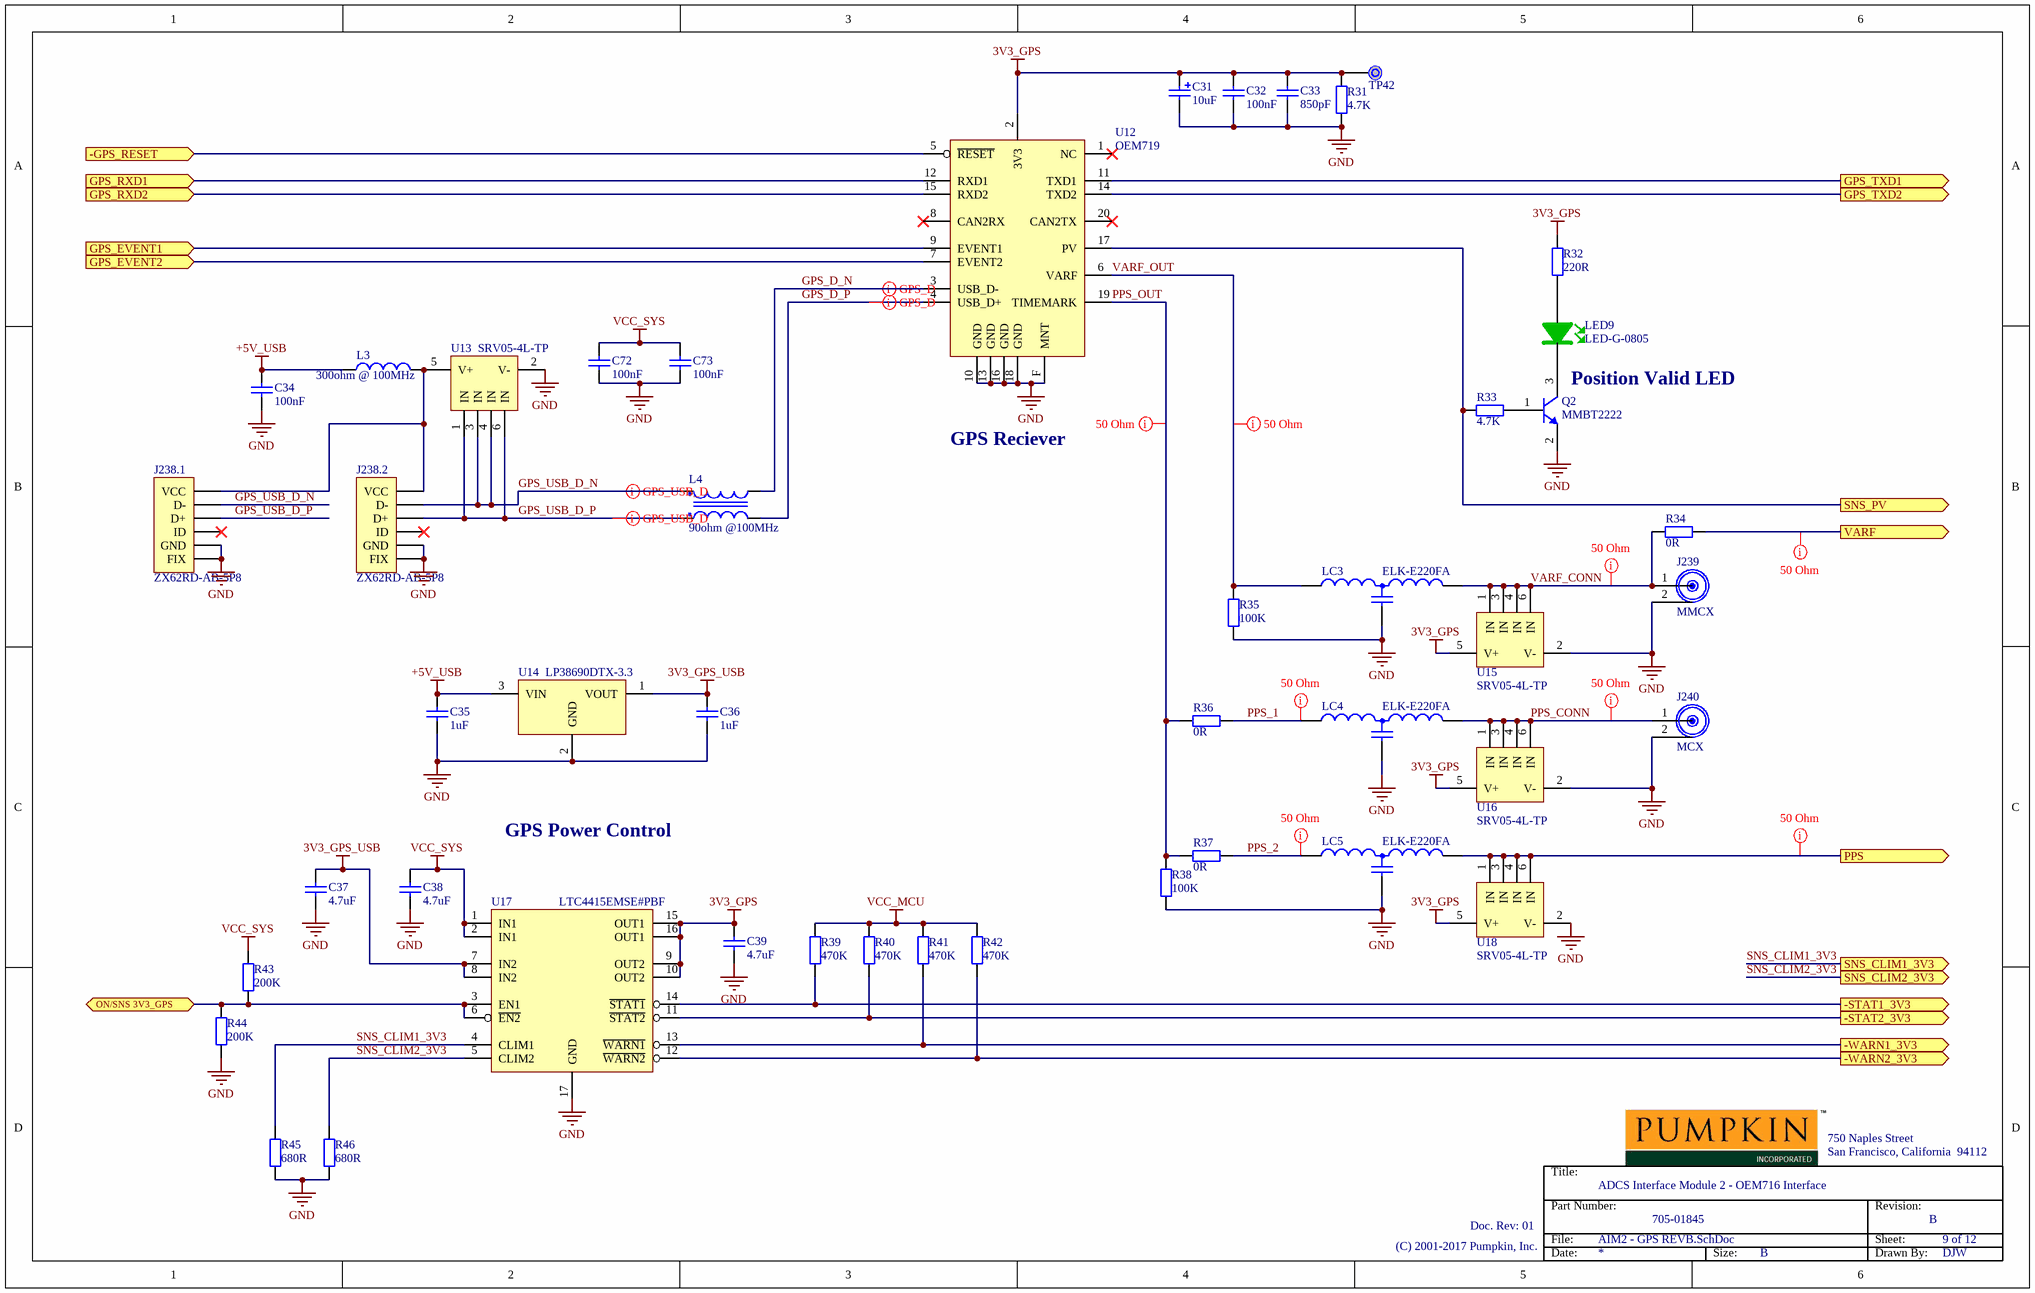
[diagram p8: AIM2 - GPS REVB.SchDoc]

### Parts
C31  10uF  [6032 POLAR CAP]
C32  100nF  [0603 CAP]
C33  850pF  [0603 CAP]
C34  100nF  [0603 CAP]
C35  1uF  [0805 CAP]
C36  1uF  [0805 CAP]
C37  4.7uF  [0805 CAP]
C38  4.7uF  [0805 CAP]
C39  4.7uF  [0805 CAP]
C72  100nF  [0603 CAP]
C73  100nF  [0603 CAP]
J238.1  ZX62RD-AB-5P8  [SM$5C$ZX62RD-AB-5P8]
J238.2  ZX62RD-AB-5P8  [SM$5C$ZX62RD-AB-5P8]
J239  MMCX  [mmcx]
J240  MCX  [MCX]
L3  300ohm @ 100MHz  [0603 IND]
L4  90ohm @100MHz  [DFN250P320X200-4N]
LC3  ELK-E220FA  [ELK]
LC4  ELK-E220FA  [ELK]
LC5  ELK-E220FA  [ELK]
LED9  LED-G-0805  [0805 LED-GREEN]
Q2  MMBT2222  [SOT23-3]
R31  4.7K  [0805 RES]
R32  220R  [0805 RES]
R33  4.7K  [0805 RES]
R34  0R  [0805 RES]
R35  100K  [0805 RES]
R36  0R  [0805 RES]
R37  0R  [0805 RES]
R38  100K  [0805 RES]
R39  470K  [0805 RES]
R40  470K  [0805 RES]
R41  470K  [0805 RES]
R42  470K  [0805 RES]
R43  200K  [0805 RES]
R44  200K  [0805 RES]
R45  680R  [0805 RES]
R46  680R  [0805 RES]
TP42  Testpoint  [Testpoint]  (value not drawn)  (no BOM)
U12  OEM719  [OEM719]
U13  SRV05-4L-TP  [SOT23-6]
U14  LP38690DTX-3.3  [DPAK]
U15  SRV05-4L-TP  [SOT23-6]
U16  SRV05-4L-TP  [SOT23-6]
U17  LTC4415EMSE#PBF  [MSOP-16]
U18  SRV05-4L-TP  [SOT23-6]

### Ports
-GPS_RESET (in), -STAT1_3V3 (out), -STAT2_3V3 (out), -WARN1_3V3 (out), -WARN2_3V3 (out), GPS_EVENT1 (in), GPS_EVENT2 (in), GPS_RXD1 (in), GPS_RXD2 (in), GPS_TXD1 (out), GPS_TXD2 (out), ON/SNS 3V3_GPS (bidir), PPS (out), SNS_CLIM1_3V3 (out), SNS_CLIM2_3V3 (out), SNS_PV (out), VARF (out)

### Nets
3V3_GPS: C31.1 C32.2 C33.2 C39.2 R31.2 R32.2 TP42.1 U12.2(3V3) U15.5(V+) U16.5(V+) U17.9(OUT2) U17.10(OUT2) U17.15(OUT1) U17.16(OUT1) U18.5(V+)
3V3_GPS_USB: C36.2 C37.2 U14.1(VOUT) U17.7(IN2) U17.8(IN2)
+5V_USB: C34.2 C35.2 L3.1 U14.3(VIN)
GND: C31.2 C32.1 C33.1 C34.1 C35.1 C36.1 C37.1 C38.1 C39.1 C72.1 C73.1 J238.1.5(GND) J238.1.F(FIX) J238.2.5(GND) J238.2.F(FIX) J239.2 J240.2 LC3.2 LC4.2 LC5.2 Q2.2(E) R31.1 R35.1 R38.1 R44.1 R45.1 R46.1 U12.10(GND) U12.13(GND) U12.16(GND) U12.18(GND) U12.F(MNT) U13.2(V-) U14.2(GND) U15.2(V-) U16.2(V-) U17.17(GND) U18.2(V-)
VCC_MCU: R39.2 R40.2 R41.2 R42.2
VCC_SYS: C38.2 C72.2 C73.2 R43.2 U17.1(IN1) U17.2(IN1)
-GPS_RESET: U12.5(~{RESET}) ; port -GPS_RESET
-STAT1_3V3: R39.1 U17.14(~{STAT1}) ; port -STAT1_3V3
-STAT2_3V3: R40.1 U17.11(~{STAT2}) ; port -STAT2_3V3
-WARN1_3V3: R41.1 U17.13(~{WARN1}) ; port -WARN1_3V3
-WARN2_3V3: R42.1 U17.12(~{WARN2}) ; port -WARN2_3V3
GPS_D_N: L4.2 U12.3(USB_D-)
GPS_D_P: L4.3 U12.4(USB_D+)
GPS_EVENT1: U12.9(EVENT1) ; port GPS_EVENT1
GPS_EVENT2: U12.7(EVENT2) ; port GPS_EVENT2
GPS_RXD2: U12.15(RXD2) ; port GPS_RXD2
GPS_TXD2: U12.14(TXD2) ; port GPS_TXD2
GPS_USB_D_N: J238.1.2(D-) J238.2.2(D-) L4.1 U13.3(IN) U13.4(IN)
GPS_USB_D_P: J238.1.3(D+) J238.2.3(D+) L4.4 U13.1(IN) U13.6(IN)
ON/SNS 3V3_GPS: R43.1 R44.2 U17.3(EN1) U17.6(~{EN2}) ; port ON/SNS 3V3_GPS
PPS: LC5.3 U18.1(IN) U18.3(IN) U18.4(IN) U18.6(IN) ; port PPS
PPS_1: LC4.1 R36.2
PPS_2: LC5.1 R37.2
PPS_CONN: J240.1 LC4.3 U16.1(IN) U16.3(IN) U16.4(IN) U16.6(IN)
PPS_OUT: R36.1 R37.1 R38.2 U12.19(TIMEMARK)
SNS_CLIM1_3V3: R45.2 U17.4(CLIM1) ; port SNS_CLIM1_3V3
SNS_CLIM2_3V3: R46.2 U17.5(CLIM2) ; port SNS_CLIM2_3V3
SNS_PV: R33.1 U12.17(PV) ; port SNS_PV
VARF: R34.2 ; port VARF
VARF_CONN: J239.1 LC3.3 R34.1 U15.1(IN) U15.3(IN) U15.4(IN) U15.6(IN)
VARF_OUT: LC3.1 R35.2 U12.6(VARF)
NetJ238.1_1: J238.1.1(VCC) J238.2.1(VCC) L3.2 U13.5(V+)
NetLED9_1: LED9.1 Q2.3(C)
NetLED9_2: LED9.2 R32.1
NetQ2_1: Q2.1(B) R33.2
NetU12_11: U12.11(TXD1) ; port GPS_TXD1
NetU12_12: U12.12(RXD1) ; port GPS_RXD1

Not connected (* = marked no-connect by the designer): J238.1 4(ID)*; J238.2 4(ID)*; U12 1(NC)* 8(CAN2RX)* 20(CAN2TX)*

### Layout directives
differential pair; rule Matched Net Lengths [Tolerance = 10mil]; net class Diff Pairs: GPS_D_N, GPS_D_P, GPS_USB_D_N, GPS_USB_D_P
net class 50 Ohm: PPS, PPS_1, PPS_2, PPS_CONN, PPS_OUT, VARF, VARF_CONN, VARF_OUT

### Notes on the sheet
- (near Q2) Position Valid LED
- GPS Reciever
- GPS Power Control
- Title:
- 750 Naples Street
- San Francisco, California  94112
- Doc. Rev: 01
- File:
- Part Number:
- Revision:
- Sheet:
- (C) 2001-2017 Pumpkin, Inc.
- Date:
- Size:
- B
- Drawn By:

### Library data of the parts
C31 = Capacitor 10uF 6032 Tantalum: Capacitor 10uF 6032 TANT 16V 10%; Value: 10uF; Supplier 1: Digi-Key; Supplier Part Number 1: 399-3732-1-ND
C32 C34 C72 C73 = Capacitor 100nF 0603: Capacitor 100nF 0603 X7R 50V 5%; Value: 100nF; Supplier 1: Digi-Key; Supplier Part Number 1: 399-7844-1-ND
C33 = Capacitor 850pF 0603: Capacitor 850pF 0603 100V; Value: 850pF; Supplier 1: Digi-Key; Supplier Part Number 1: 1761-1075-1-ND
C35 C36 = Capacitor 1uF 0805: Capacitor 1uF 0805 X7R 25V 10%; Value: 1uF; Supplier 1: Digi-Key; Supplier Part Number 1: 445-5687-1-ND
C37-C39 = Capacitor 4.7uF 0805: Capacitor 4.7uF 0805 X7R 35V 10%; Value: 4.7uF; Supplier 1: Digi-Key; Supplier Part Number 1: 445-172479-1-ND
J238.1 J238.2 = ZX62RD-AB-5P8: Header USB Micro AB; Supplier 1: Digi-Key; Supplier Part Number 1: H11611CT-ND
J239 = MMCX: Header MMCX Through-hole vertical; Supplier 1: Digi-Key; Supplier Part Number 1: WM9481-ND
J240 = MCX: Header MCX Through-hole vertical; Supplier 1: Digi-Key; Supplier Part Number 1: SAM8944-ND
L3 = Ferrite Bead 300ohm @ 100MHz: Revision: July-2002: Re-released for DXP Platform.; Value: 300ohm @ 100MHz; Supplier 1: Digi-Key; Supplier Part Number 1: 732-1592-1-ND
L4 = Choke 90ohm @ 100MHz: Choke Common-mode 90ohm @ 100MHz; Supplier 1: Digi-Key; Supplier Part Number 1: 732-1469-1-ND
LC3-LC5 = LC Filter: Filter LC 100MHz; Supplier 1: Digi-Key; Supplier Part Number 1: P9871DKR-ND
LED9 = LED GREEN 0805: Supplier 1: Digi-Key; Supplier Part Number 1: 160-1414-1-ND
Q2 = MMBT2222ALT1GOSCT-ND: Transistor NPN; Supplier 1: Digi-Key; Supplier Part Number 1: MMBT2222ALT1GOSCT-ND
R31 R33 = Resistor 4K7 0805: Resistor 4.7K 0805 0.125W 1%; Revision: Altium ETH 11-03.2008; Value: 4.7K; Supplier 1: Digi-Key; Supplier Part Number 1: 311-4.70KCRCT-ND
R32 = Resistor 220R 0805: Resistor 220R 0805 0.125W 1%; Revision: Altium ETH 11-03.2008; Value: 220R; Supplier 1: Digi-Key; Supplier Part Number 1: P220CCT-ND
R34 R36 R37 = Resistor 0R 0805: Resistor 0R 0805 0.125W; Revision: Altium ETH 11-03.2008; Value: 0R; Supplier 1: Digi-Key; Supplier Part Number 1: P0.0ACT-ND
R35 R38 = Resistor 100K 0805: Resistor 100K 0805 0.5W 1%; Revision: Altium ETH 11-03.2008; Value: 100K; Supplier 1: Digi-Key; Supplier Part Number 1: P16060CT-ND
R39-R42 = Resistor 470K 0805: Resistor 470K 0805 0.125W 0.1%; Revision: Altium ETH 11-03.2008; Value: 470K; Supplier 1: Digi-Key; Supplier Part Number 1: P470KDACT-ND
R43 R44 = Resistor 200K 0805: Resistor 200K 0805 0.125W 1%; Revision: Altium ETH 11-03.2008; Value: 200K; Supplier 1: Digi-Key; Supplier Part Number 1: P200KCCT-ND
R45 R46 = Resistor 680R 0805: Resistor 470K 0805 0.125W 1%; Revision: Altium ETH 11-03.2008; Value: 680R; Supplier 1: Digi-Key; Supplier Part Number 1: 311-680CRCT-ND
U12 = OEM719: GPS Reciever; Supplier 1: Digi-Key; Supplier Part Number 1: SAM12500-ND
U13 U15 U16 U18 = SRV05-4L-TP: IC ESD protection 4 input; Supplier 1: Digi-Key; Supplier Part Number 1: SRV05-4L-TPMSCT-ND
U14 = LP38690DTX-3.3: Regulator 3.3V LDO; Supplier 1: Digi-Key; Supplier Part Number 1: LP38690DTX-3.3/NOPBCT-ND
U17 = LTC4415: IC Driver Dual Idewal Diode; Supplier 1: Digi-Key; Supplier Part Number 1: LTC4415EMSE#PBF-ND

## Sheet AIM2 - GPS Multiplexing REVB.SchDoc: GPS UART Multiplexing
size B; DrawnBy: DJW; DocumentNumber: 8; SheetNumber: 8; SheetTotal: 12
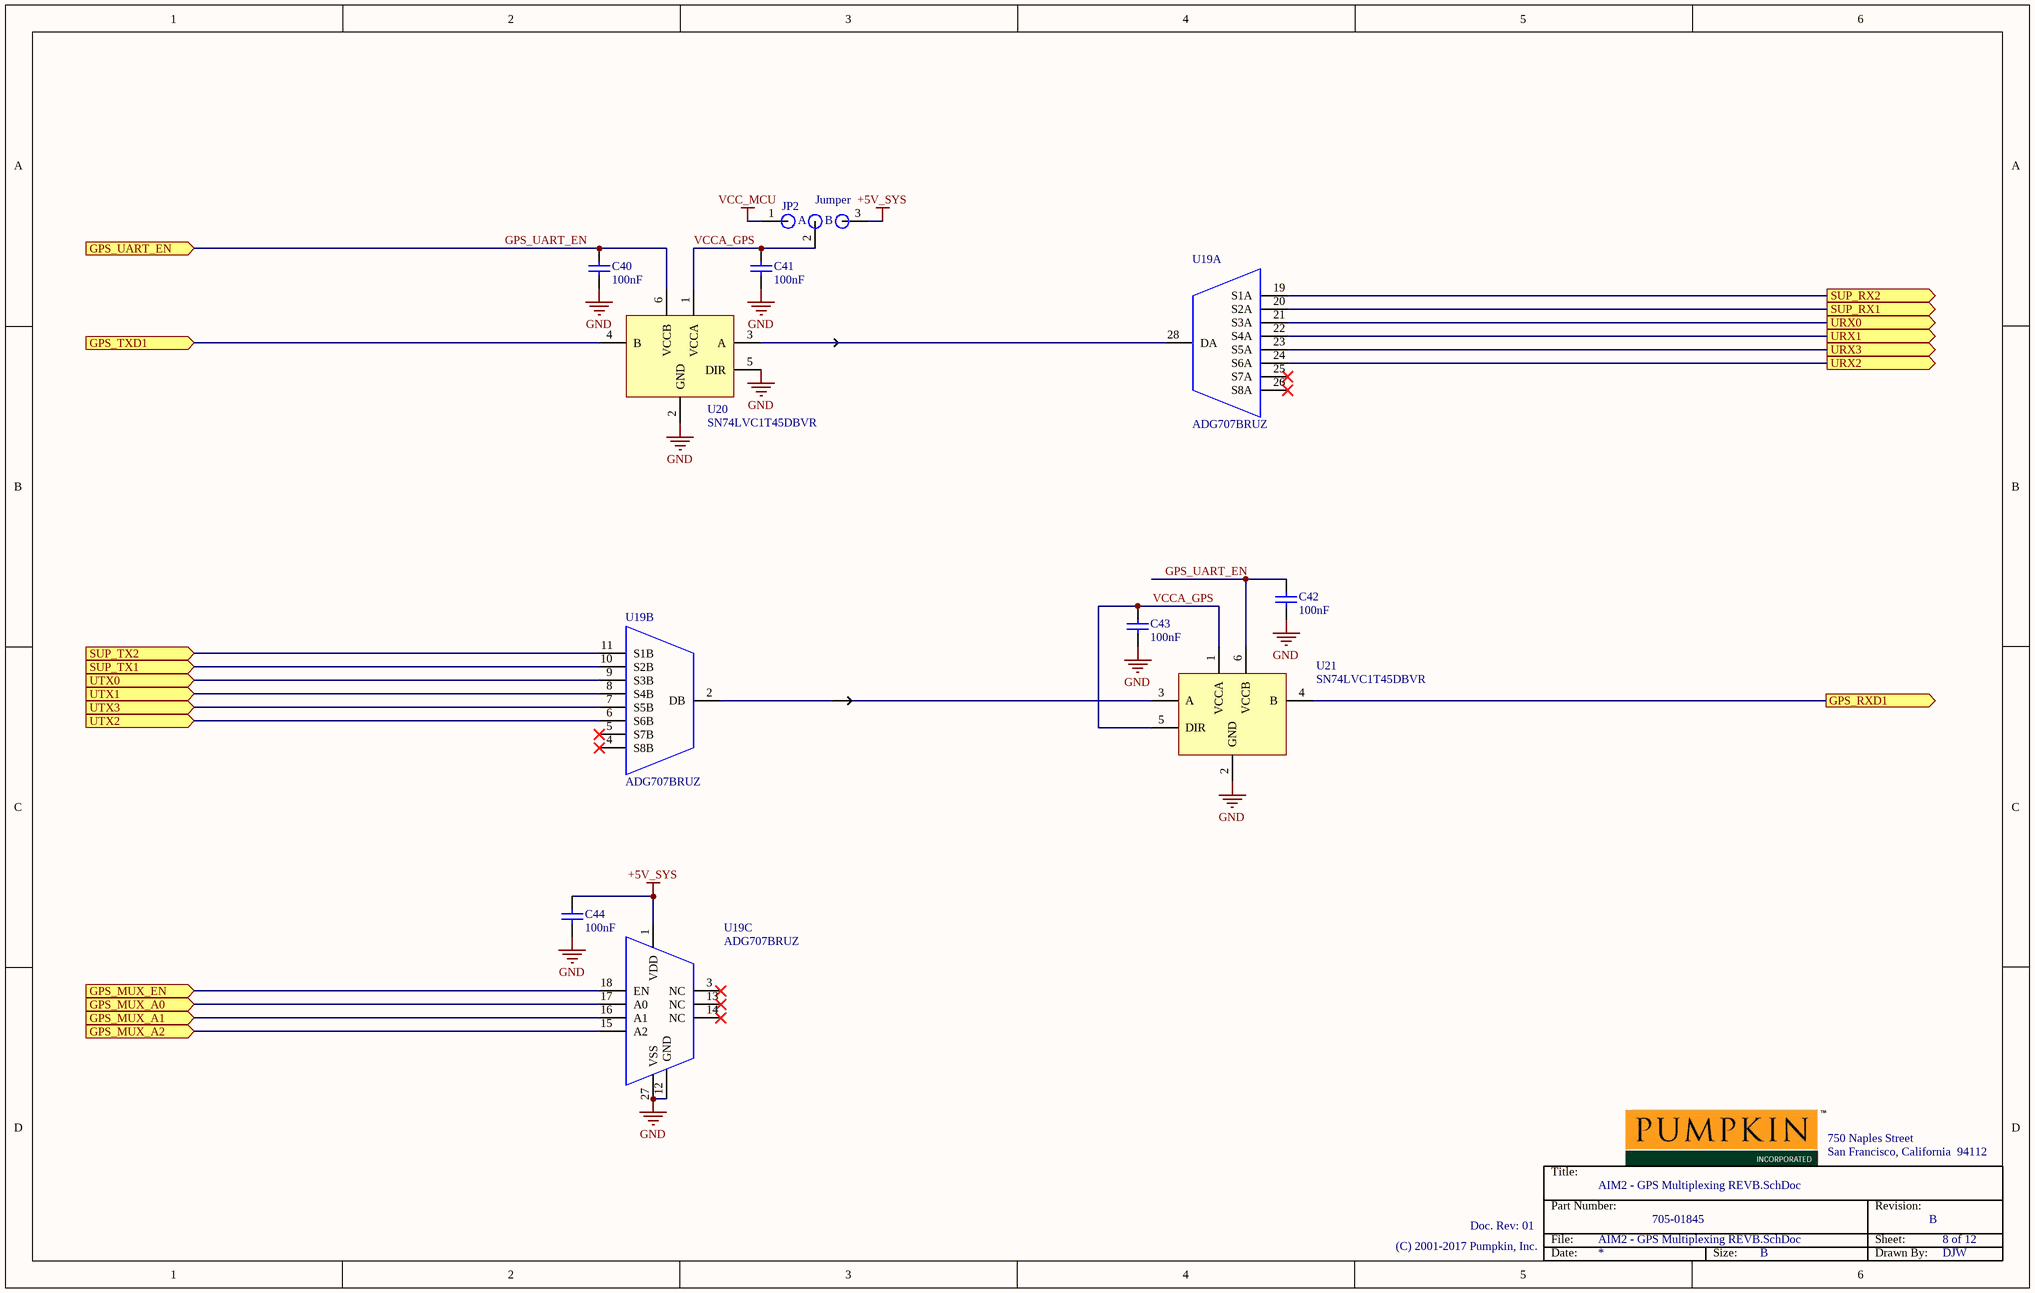
[diagram p9: AIM2 - GPS Multiplexing REVB.SchDoc]

### Parts
C40  100nF  [0603 CAP]
C41  100nF  [0603 CAP]
C42  100nF  [0603 CAP]
C43  100nF  [0603 CAP]
C44  100nF  [0603 CAP]
JP2  Jumper  [0805 RES 2 way jumper - 1]
U19  ADG707BRUZ  [28-TSSOP]  (parts A,B,C of 3)
U20  SN74LVC1T45DBVR  [SOT23-6]
U21  SN74LVC1T45DBVR  [SOT23-6]

### Ports
GPS_MUX_A0 (in), GPS_MUX_A1 (in), GPS_MUX_A2 (in), GPS_MUX_EN (in), GPS_RXD1 (out), GPS_TXD1 (in), GPS_UART_EN (in), SUP_RX1 (out), SUP_RX2 (out), SUP_TX1 (in), SUP_TX2 (in), URX0 (out), URX1 (out), URX2 (out), URX3 (out), UTX0 (in), UTX1 (in), UTX2 (in), UTX3 (in)

### Nets
+5V_SYS: C44.2 JP2.3 U19.1(VDD)
GND: C40.1 C41.1 C42.1 C43.1 C44.1 U19.12(GND) U19.27(VSS) U20.2(GND) U20.5(DIR) U21.2(GND)
VCC_MCU: JP2.1
GPS_MUX_A0: U19.17(A0) ; port GPS_MUX_A0
GPS_MUX_A1: U19.16(A1) ; port GPS_MUX_A1
GPS_MUX_A2: U19.15(A2) ; port GPS_MUX_A2
GPS_MUX_EN: U19.18(EN) ; port GPS_MUX_EN
GPS_UART_EN: C40.2 C42.2 U20.6(VCCB) U21.6(VCCB) ; port GPS_UART_EN
SUP_RX1: U19.20(S2A) ; port SUP_RX1
SUP_RX2: U19.19(S1A) ; port SUP_RX2
SUP_TX1: U19.10(S2B) ; port SUP_TX1
SUP_TX2: U19.11(S1B) ; port SUP_TX2
URX0: U19.21(S3A) ; port URX0
URX1: U19.22(S4A) ; port URX1
URX2: U19.24(S6A) ; port URX2
URX3: U19.23(S5A) ; port URX3
UTX0: U19.9(S3B) ; port UTX0
UTX1: U19.8(S4B) ; port UTX1
UTX2: U19.6(S6B) ; port UTX2
UTX3: U19.7(S5B) ; port UTX3
VCCA_GPS: C41.2 C43.2 JP2.2 U20.1(VCCA) U21.1(VCCA) U21.5(DIR)
NetU12_11: U20.4(B) ; port GPS_TXD1
NetU12_12: U21.4(B) ; port GPS_RXD1
NetU19_2: U19.2(DB) U21.3(A)
NetU19_28: U19.28(DA) U20.3(A)

Not connected (* = marked no-connect by the designer): U19 3(NC)* 4(S8B)* 5(S7B)* 13(NC)* 14(NC)* 25(S7A)* 26(S8A)*

### Notes on the sheet
- Title:
- 750 Naples Street
- San Francisco, California  94112
- Doc. Rev: 01
- File:
- Part Number:
- Revision:
- Sheet:
- (C) 2001-2017 Pumpkin, Inc.
- Date:
- Size:
- B
- Drawn By:
- (in symbol Jumper 2 way 0805) A; B

### Library data of the parts
C40-C44 = Capacitor 100nF 0603: Capacitor 100nF 0603 X7R 50V 5%; Value: 100nF; Supplier 1: Digi-Key; Supplier Part Number 1: 399-7844-1-ND
JP2 = Jumper 2 way 0805: Jumper 0805 2 pos; Supplier 1: Digi-Key; Supplier Part Number 1: P0.0ACT-ND
U19 = ADG707BRUZ: IC Multiplexer 2x 8:1; Supplier 1: Digi-Key; Supplier Part Number 1: ADG707BRUZ-ND
U20 U21 = SN74LVC1T45DBVR: IC Logic Isolator 1 channel; Supplier 1: Digi-Key; Supplier Part Number 1: 296-16843-1-ND